# EAGLE schematic main_interrupts_dma (EAGLE 7.6.0), part 1 of 2
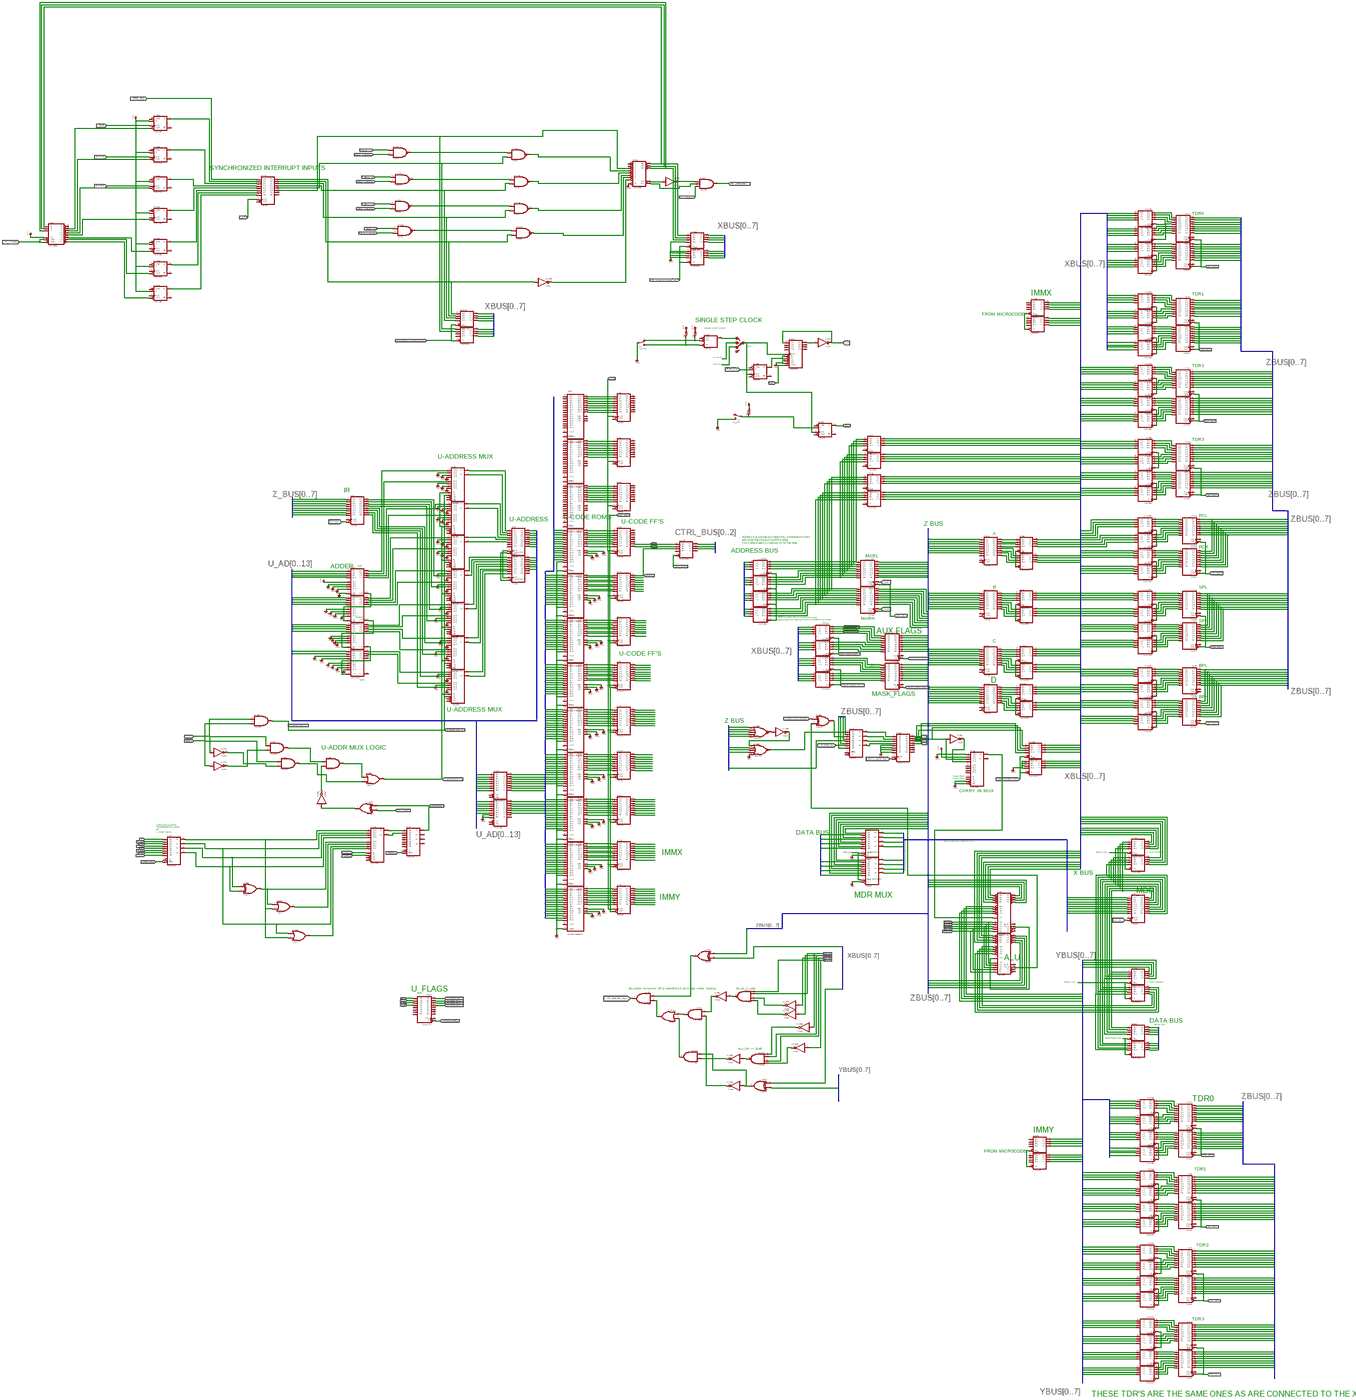
[diagram p0: schematic, sheet 1, overview]
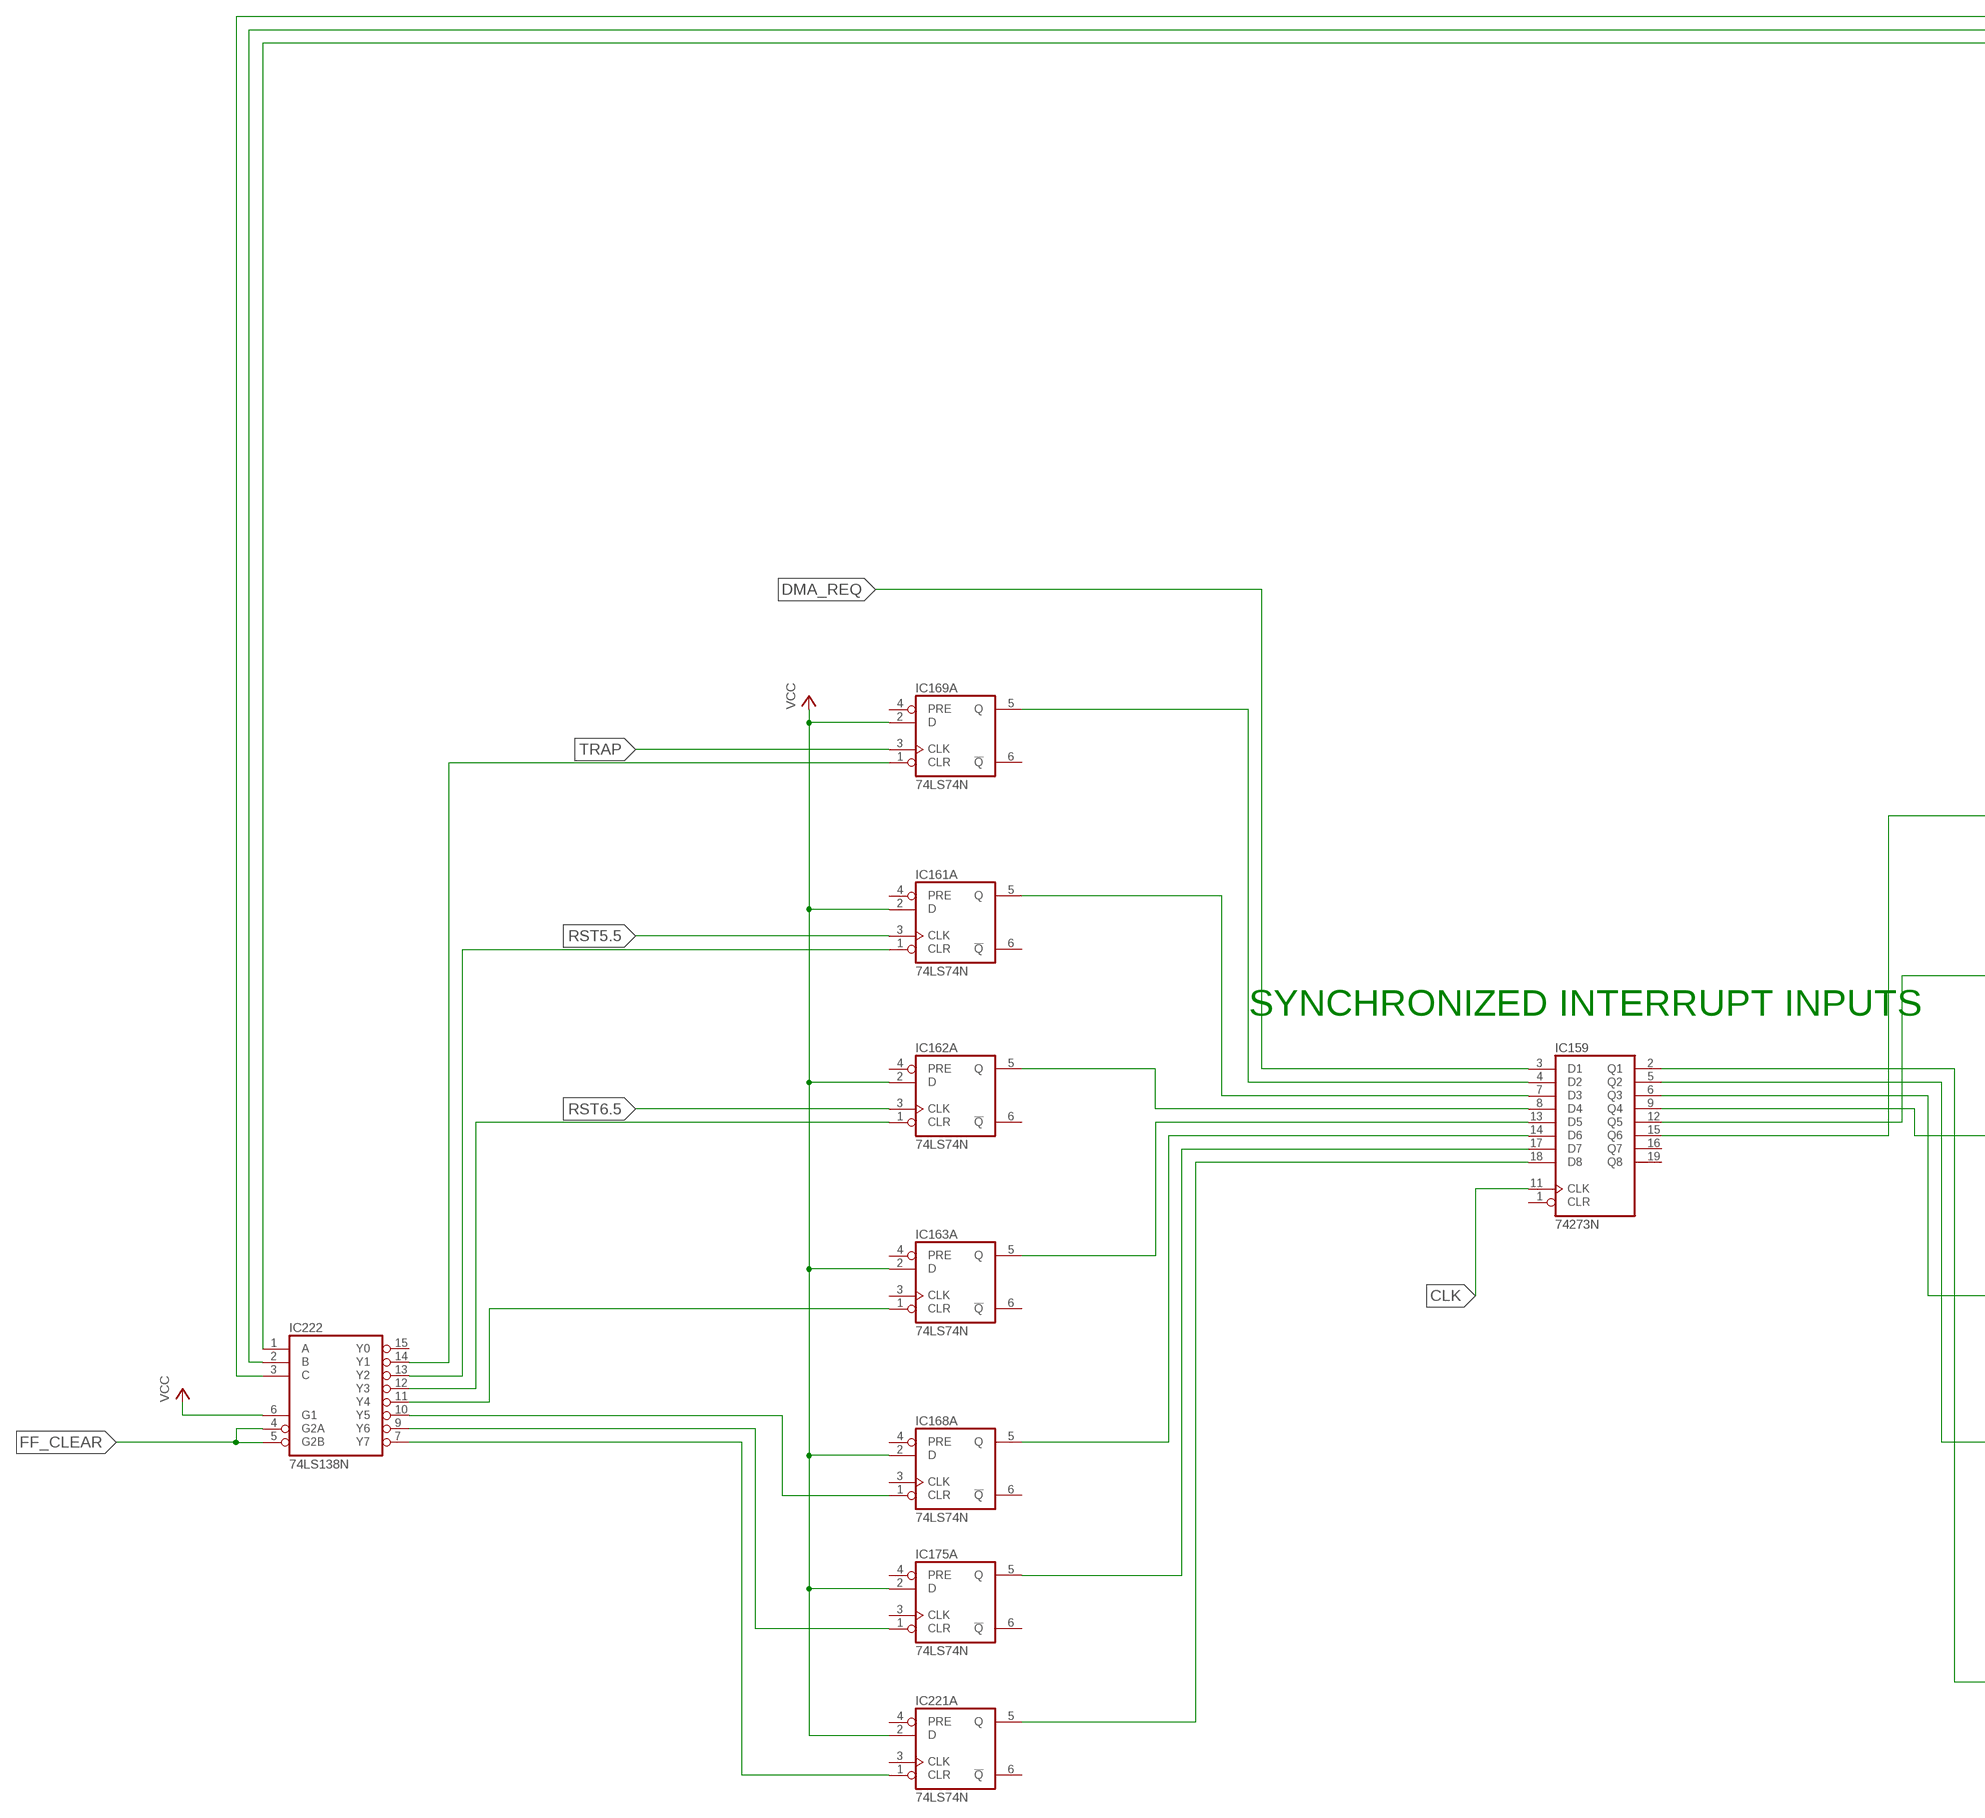
[diagram p1: schematic, sheet 1, part 1 of 8]
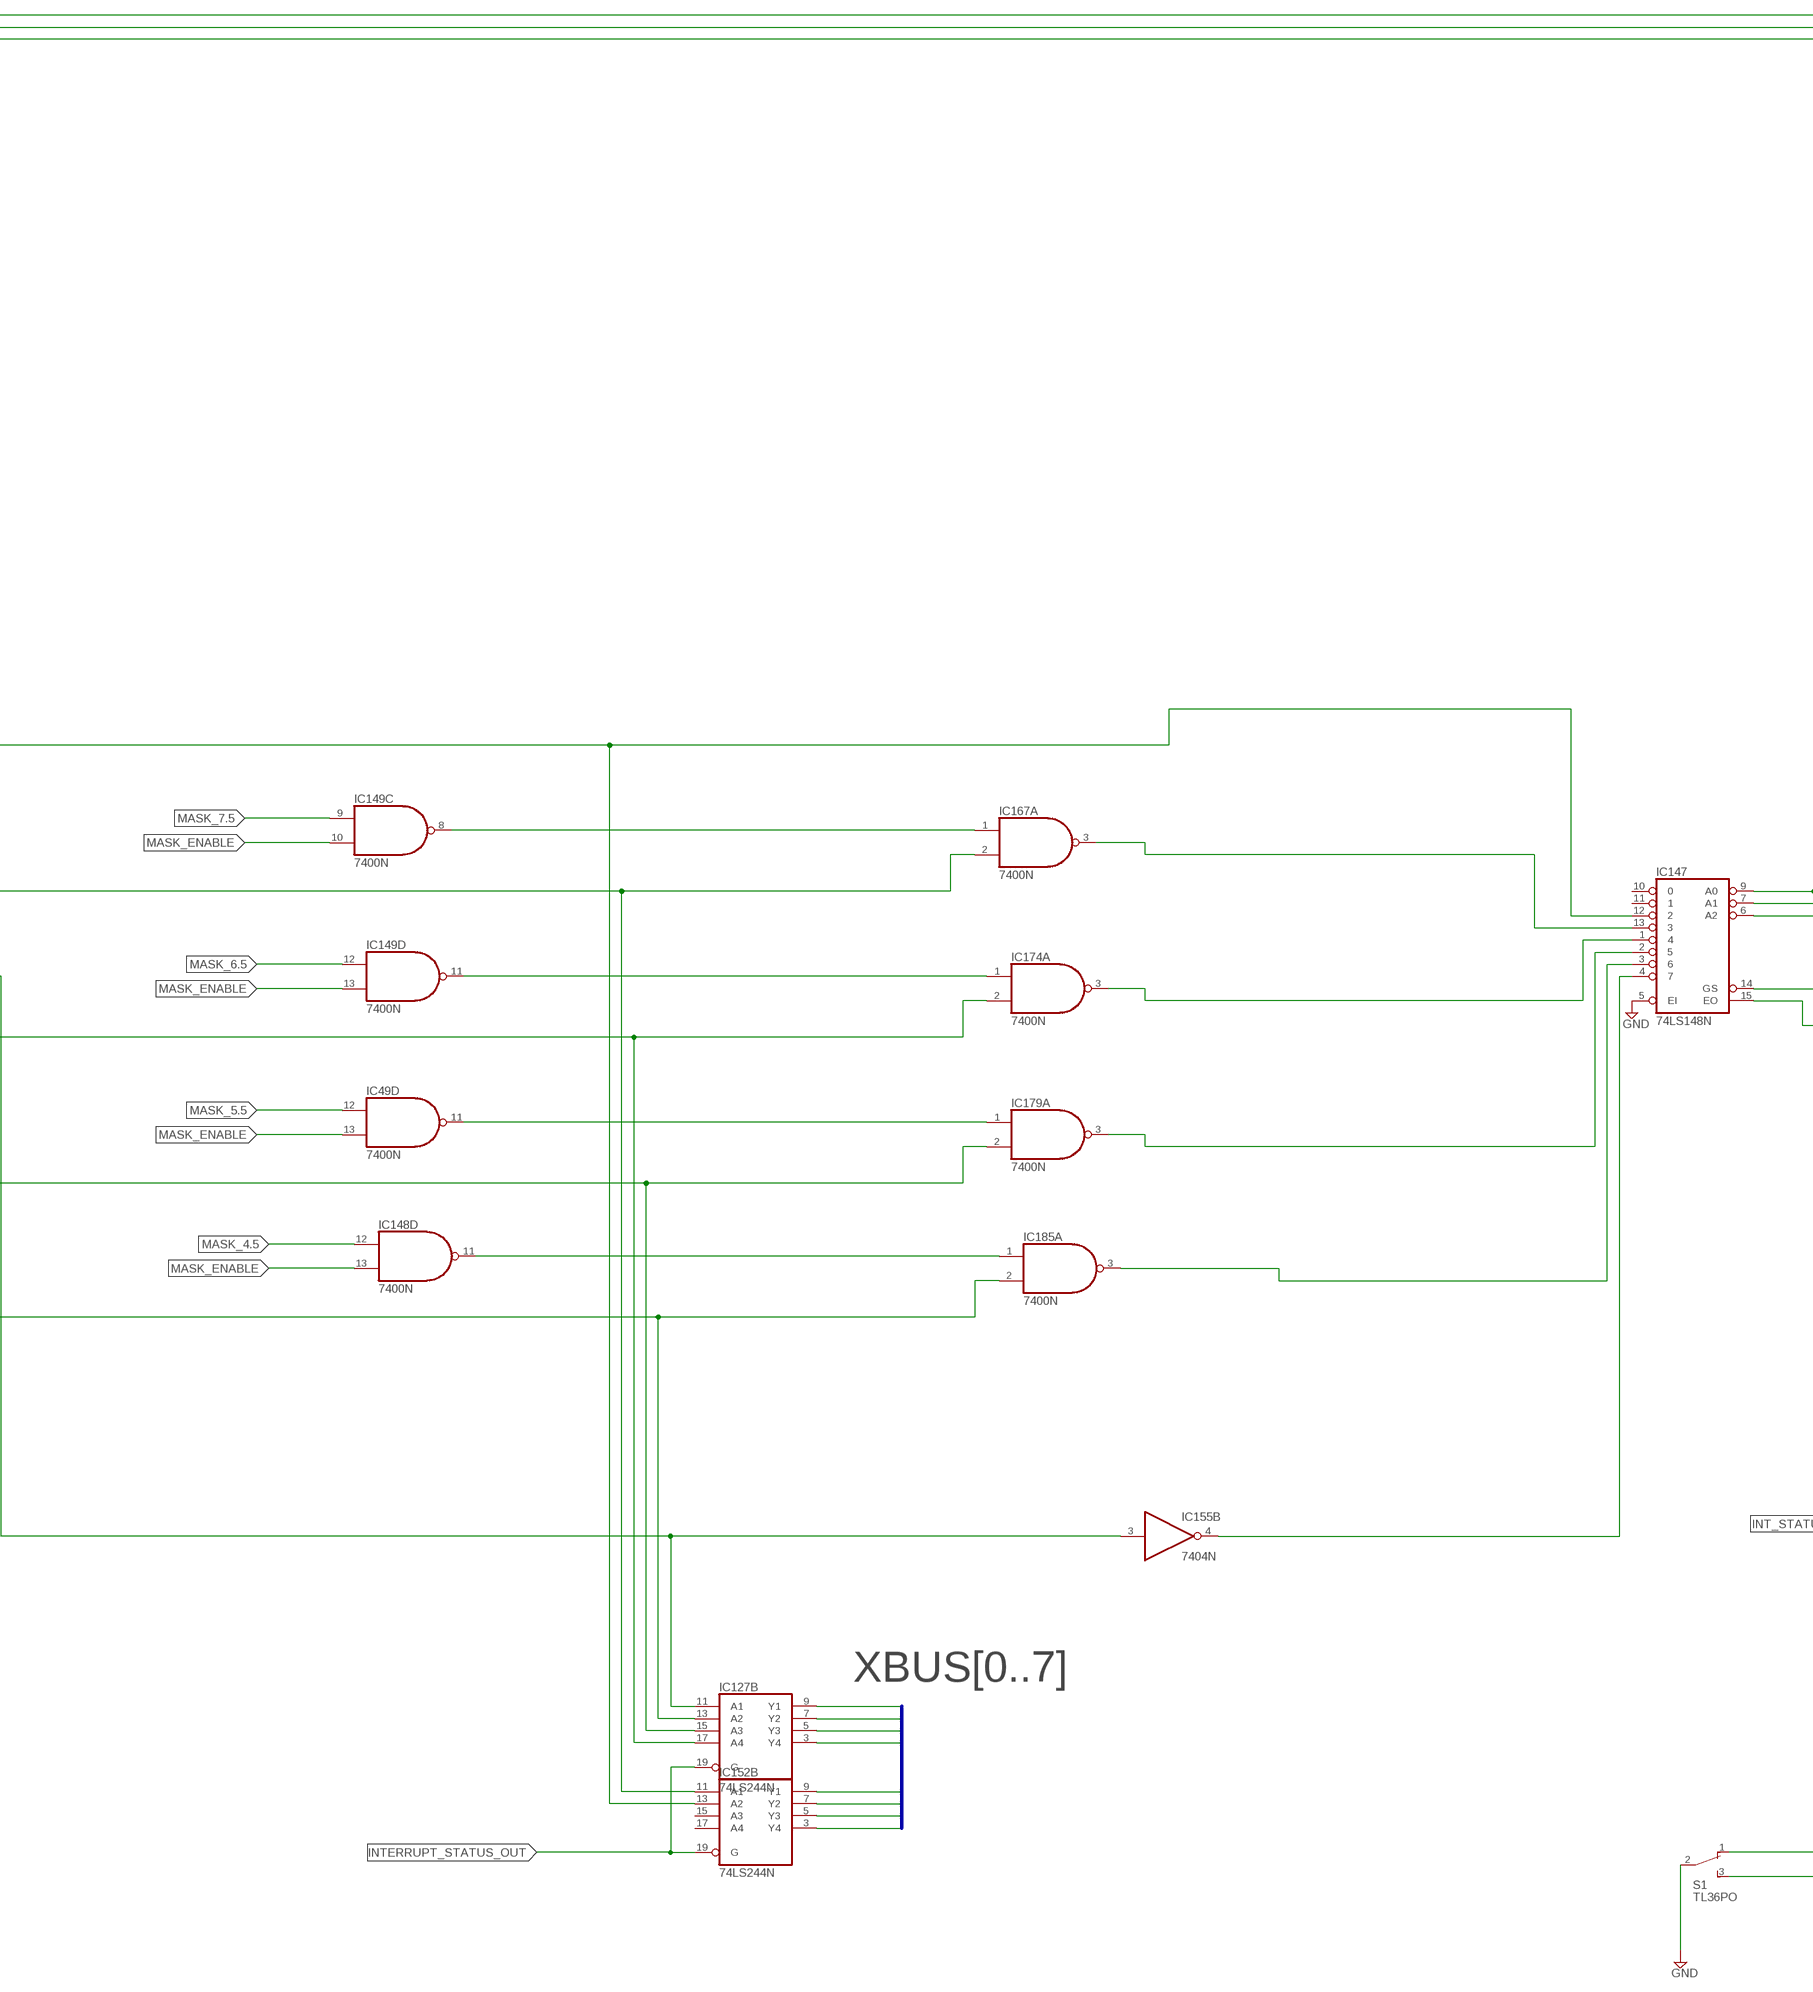
[diagram p2: schematic, sheet 1, part 2 of 8]
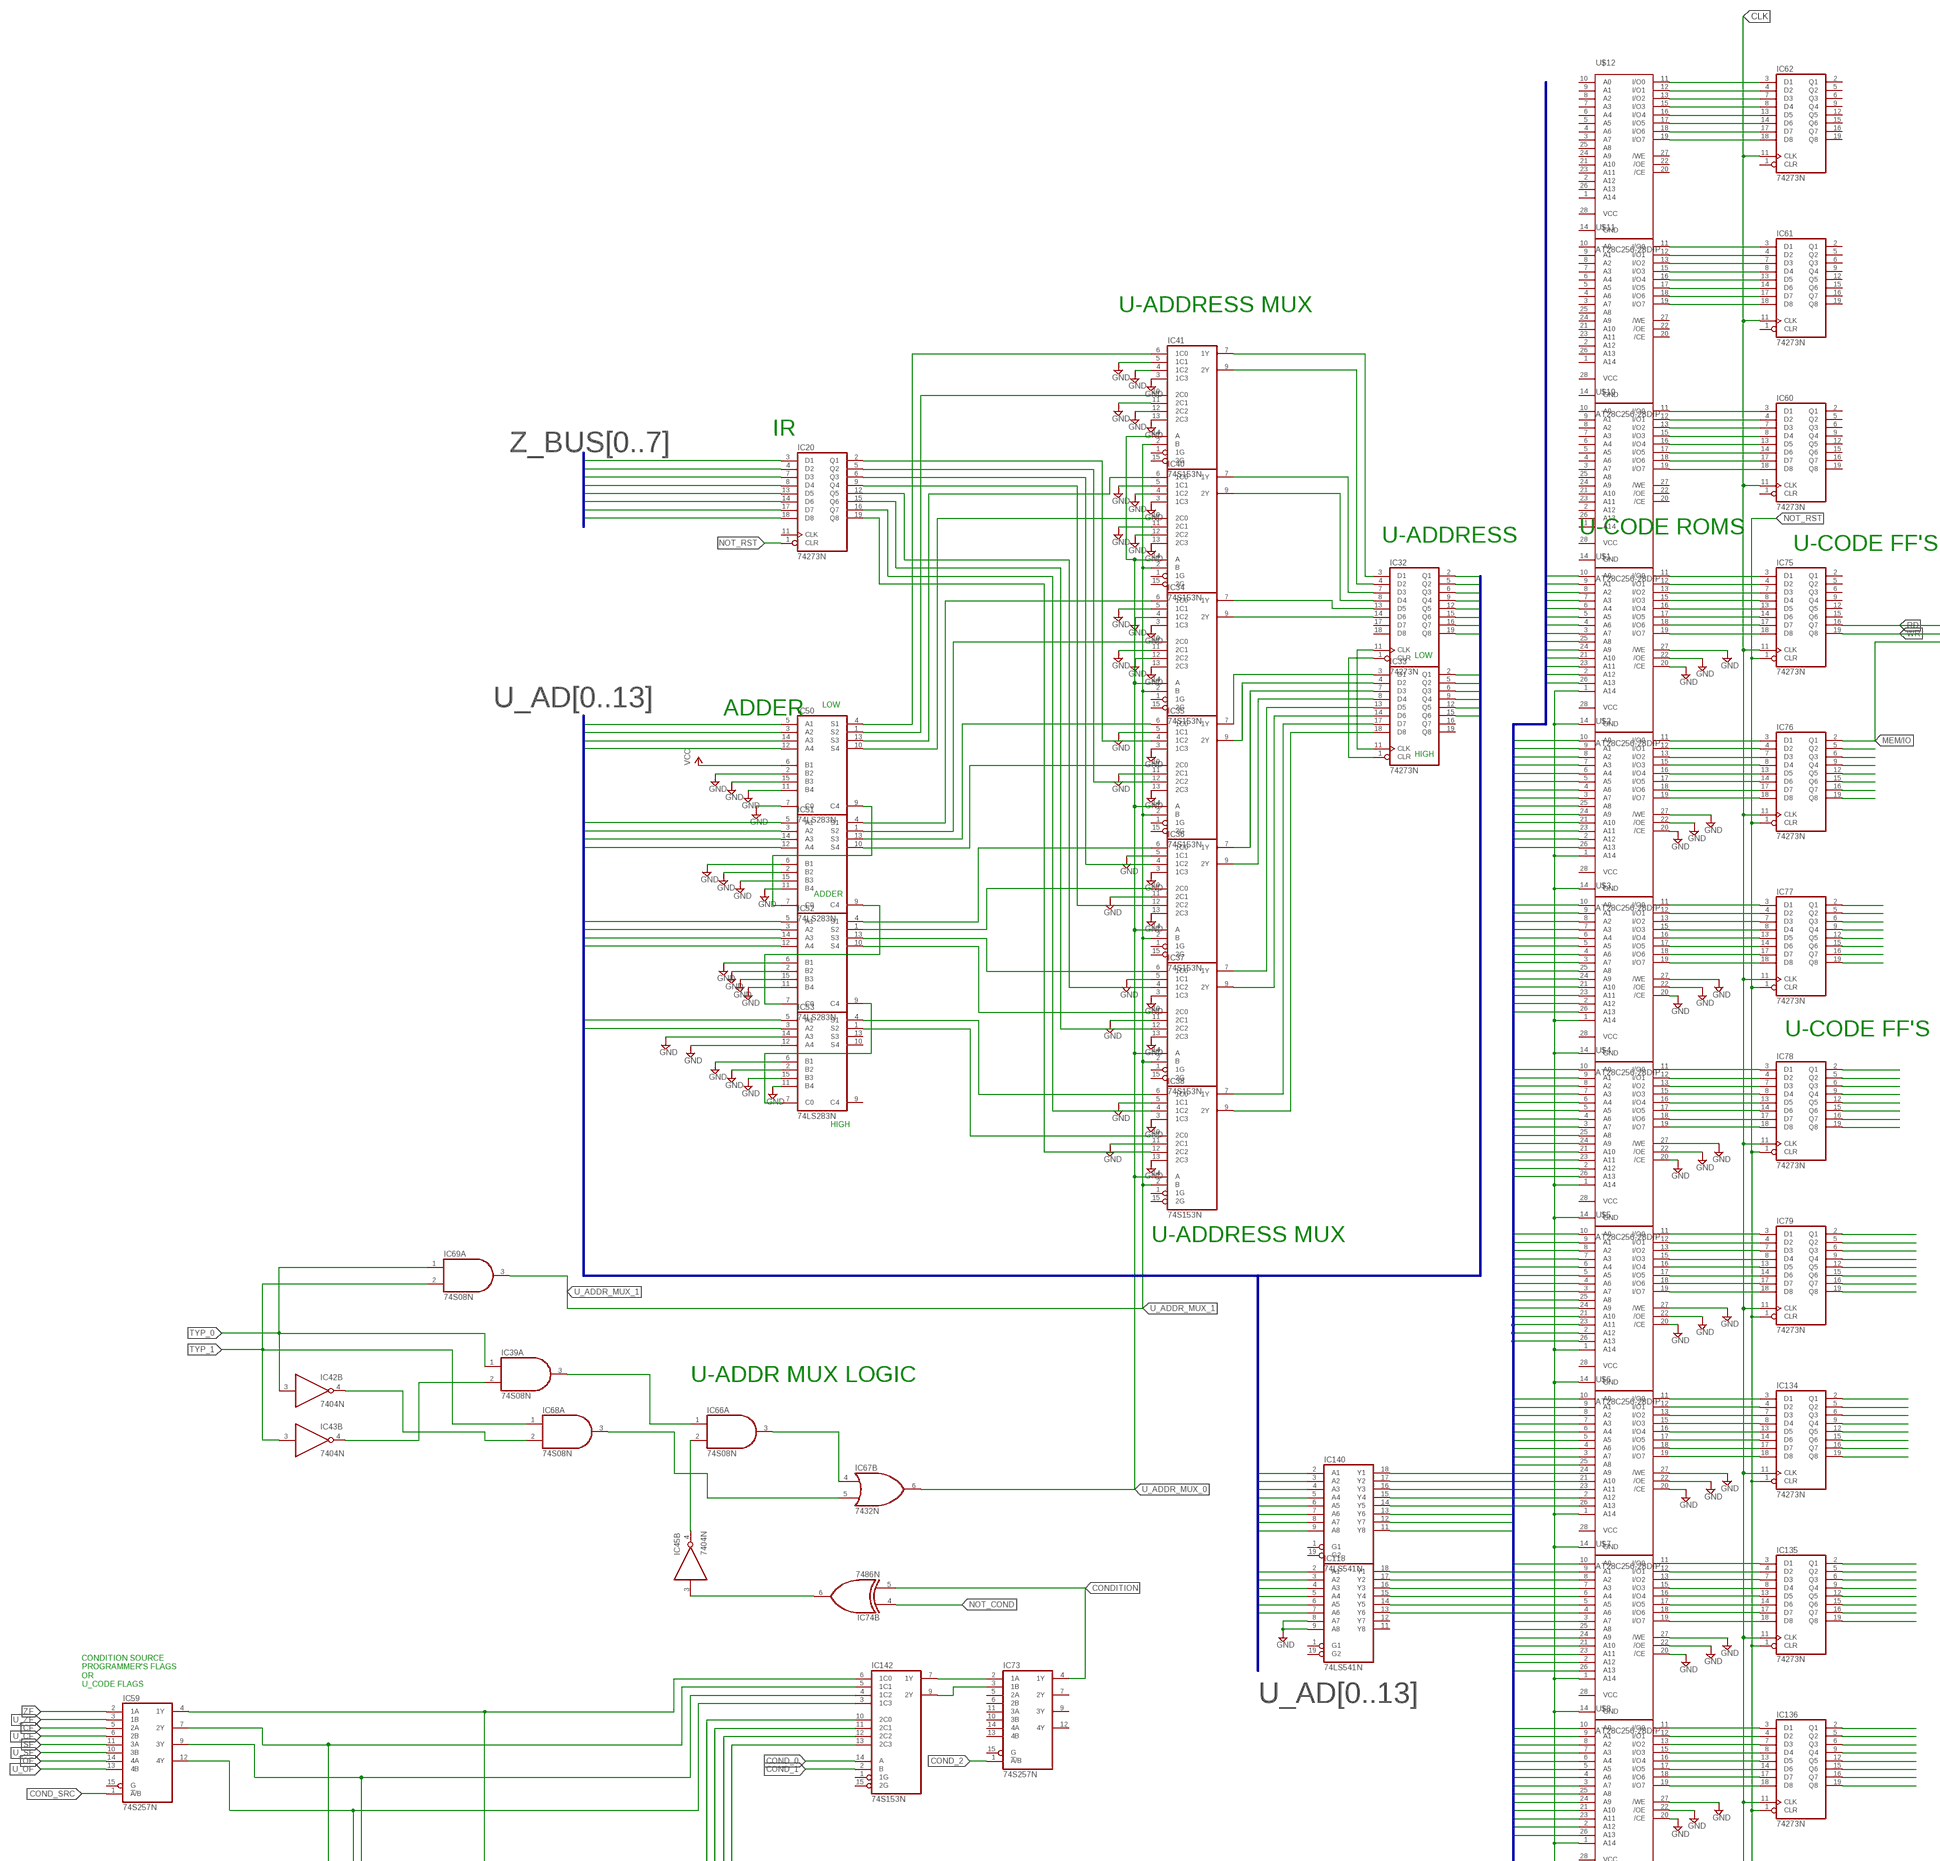
[diagram p3: schematic, sheet 1, part 3 of 8]
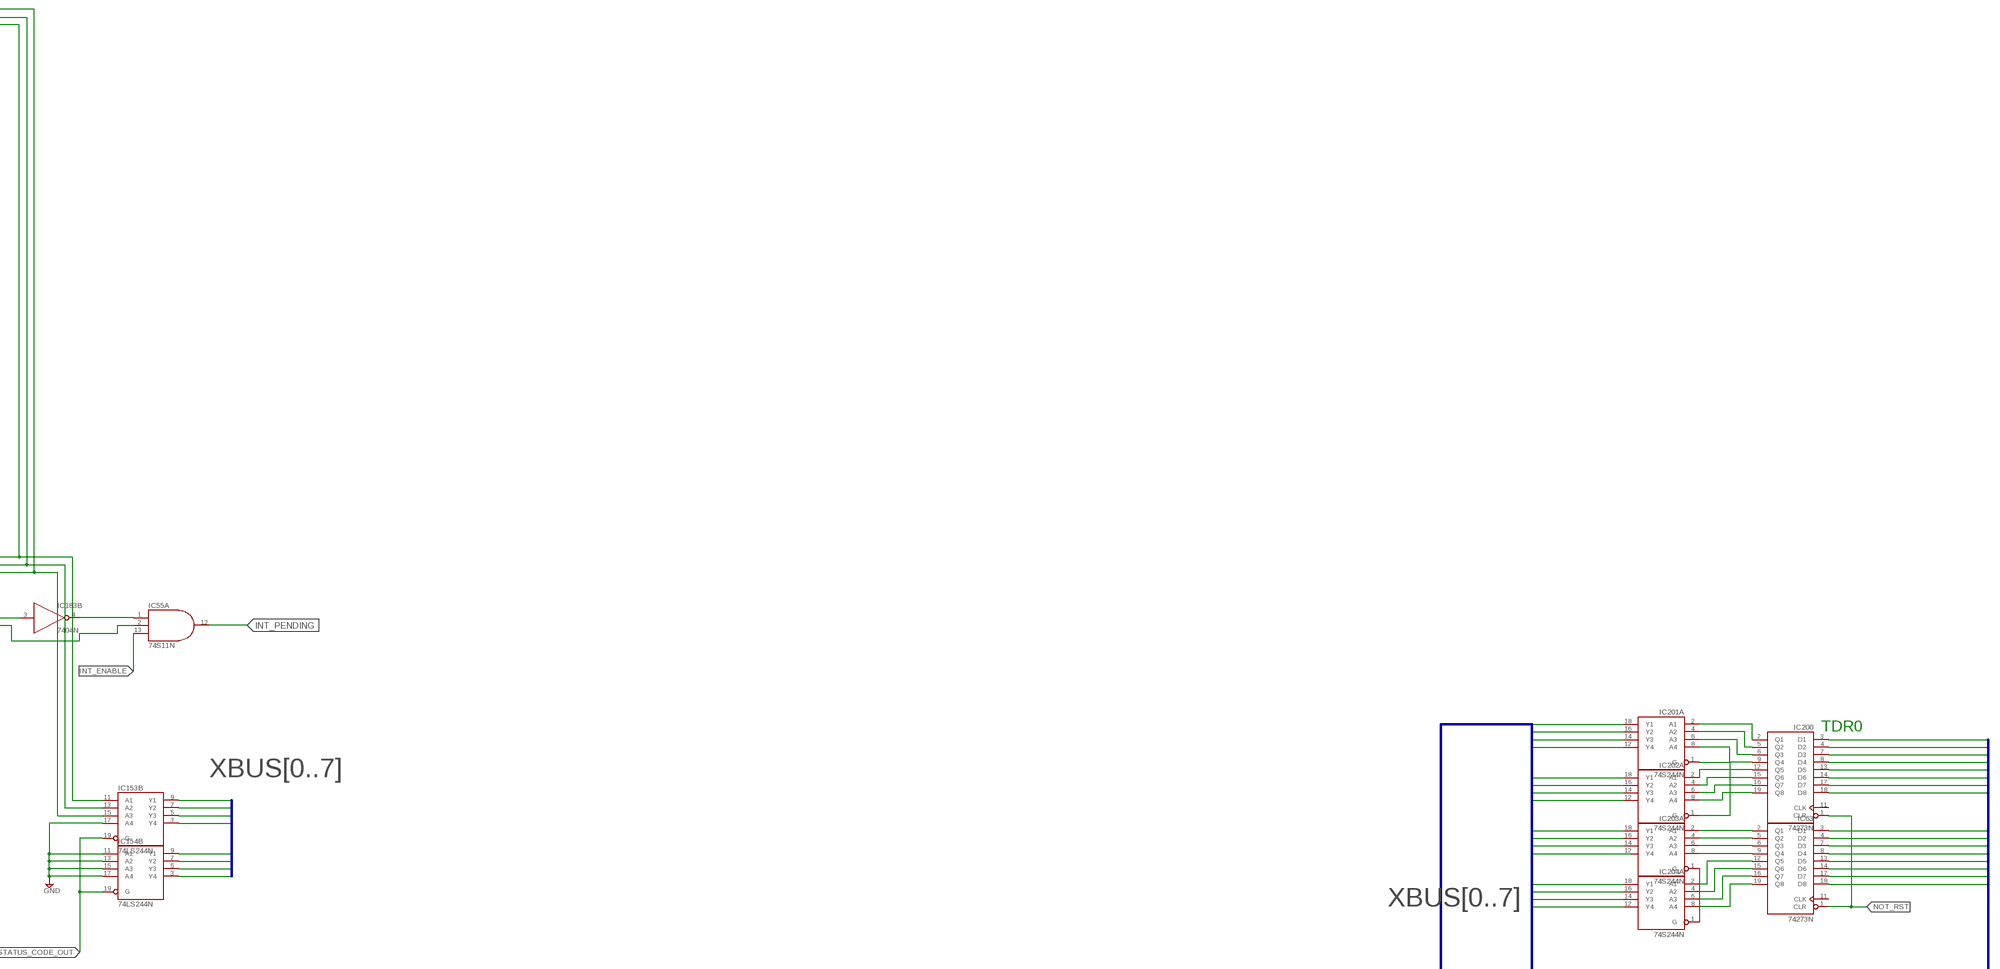
[diagram p4: schematic, sheet 1, part 4 of 8]
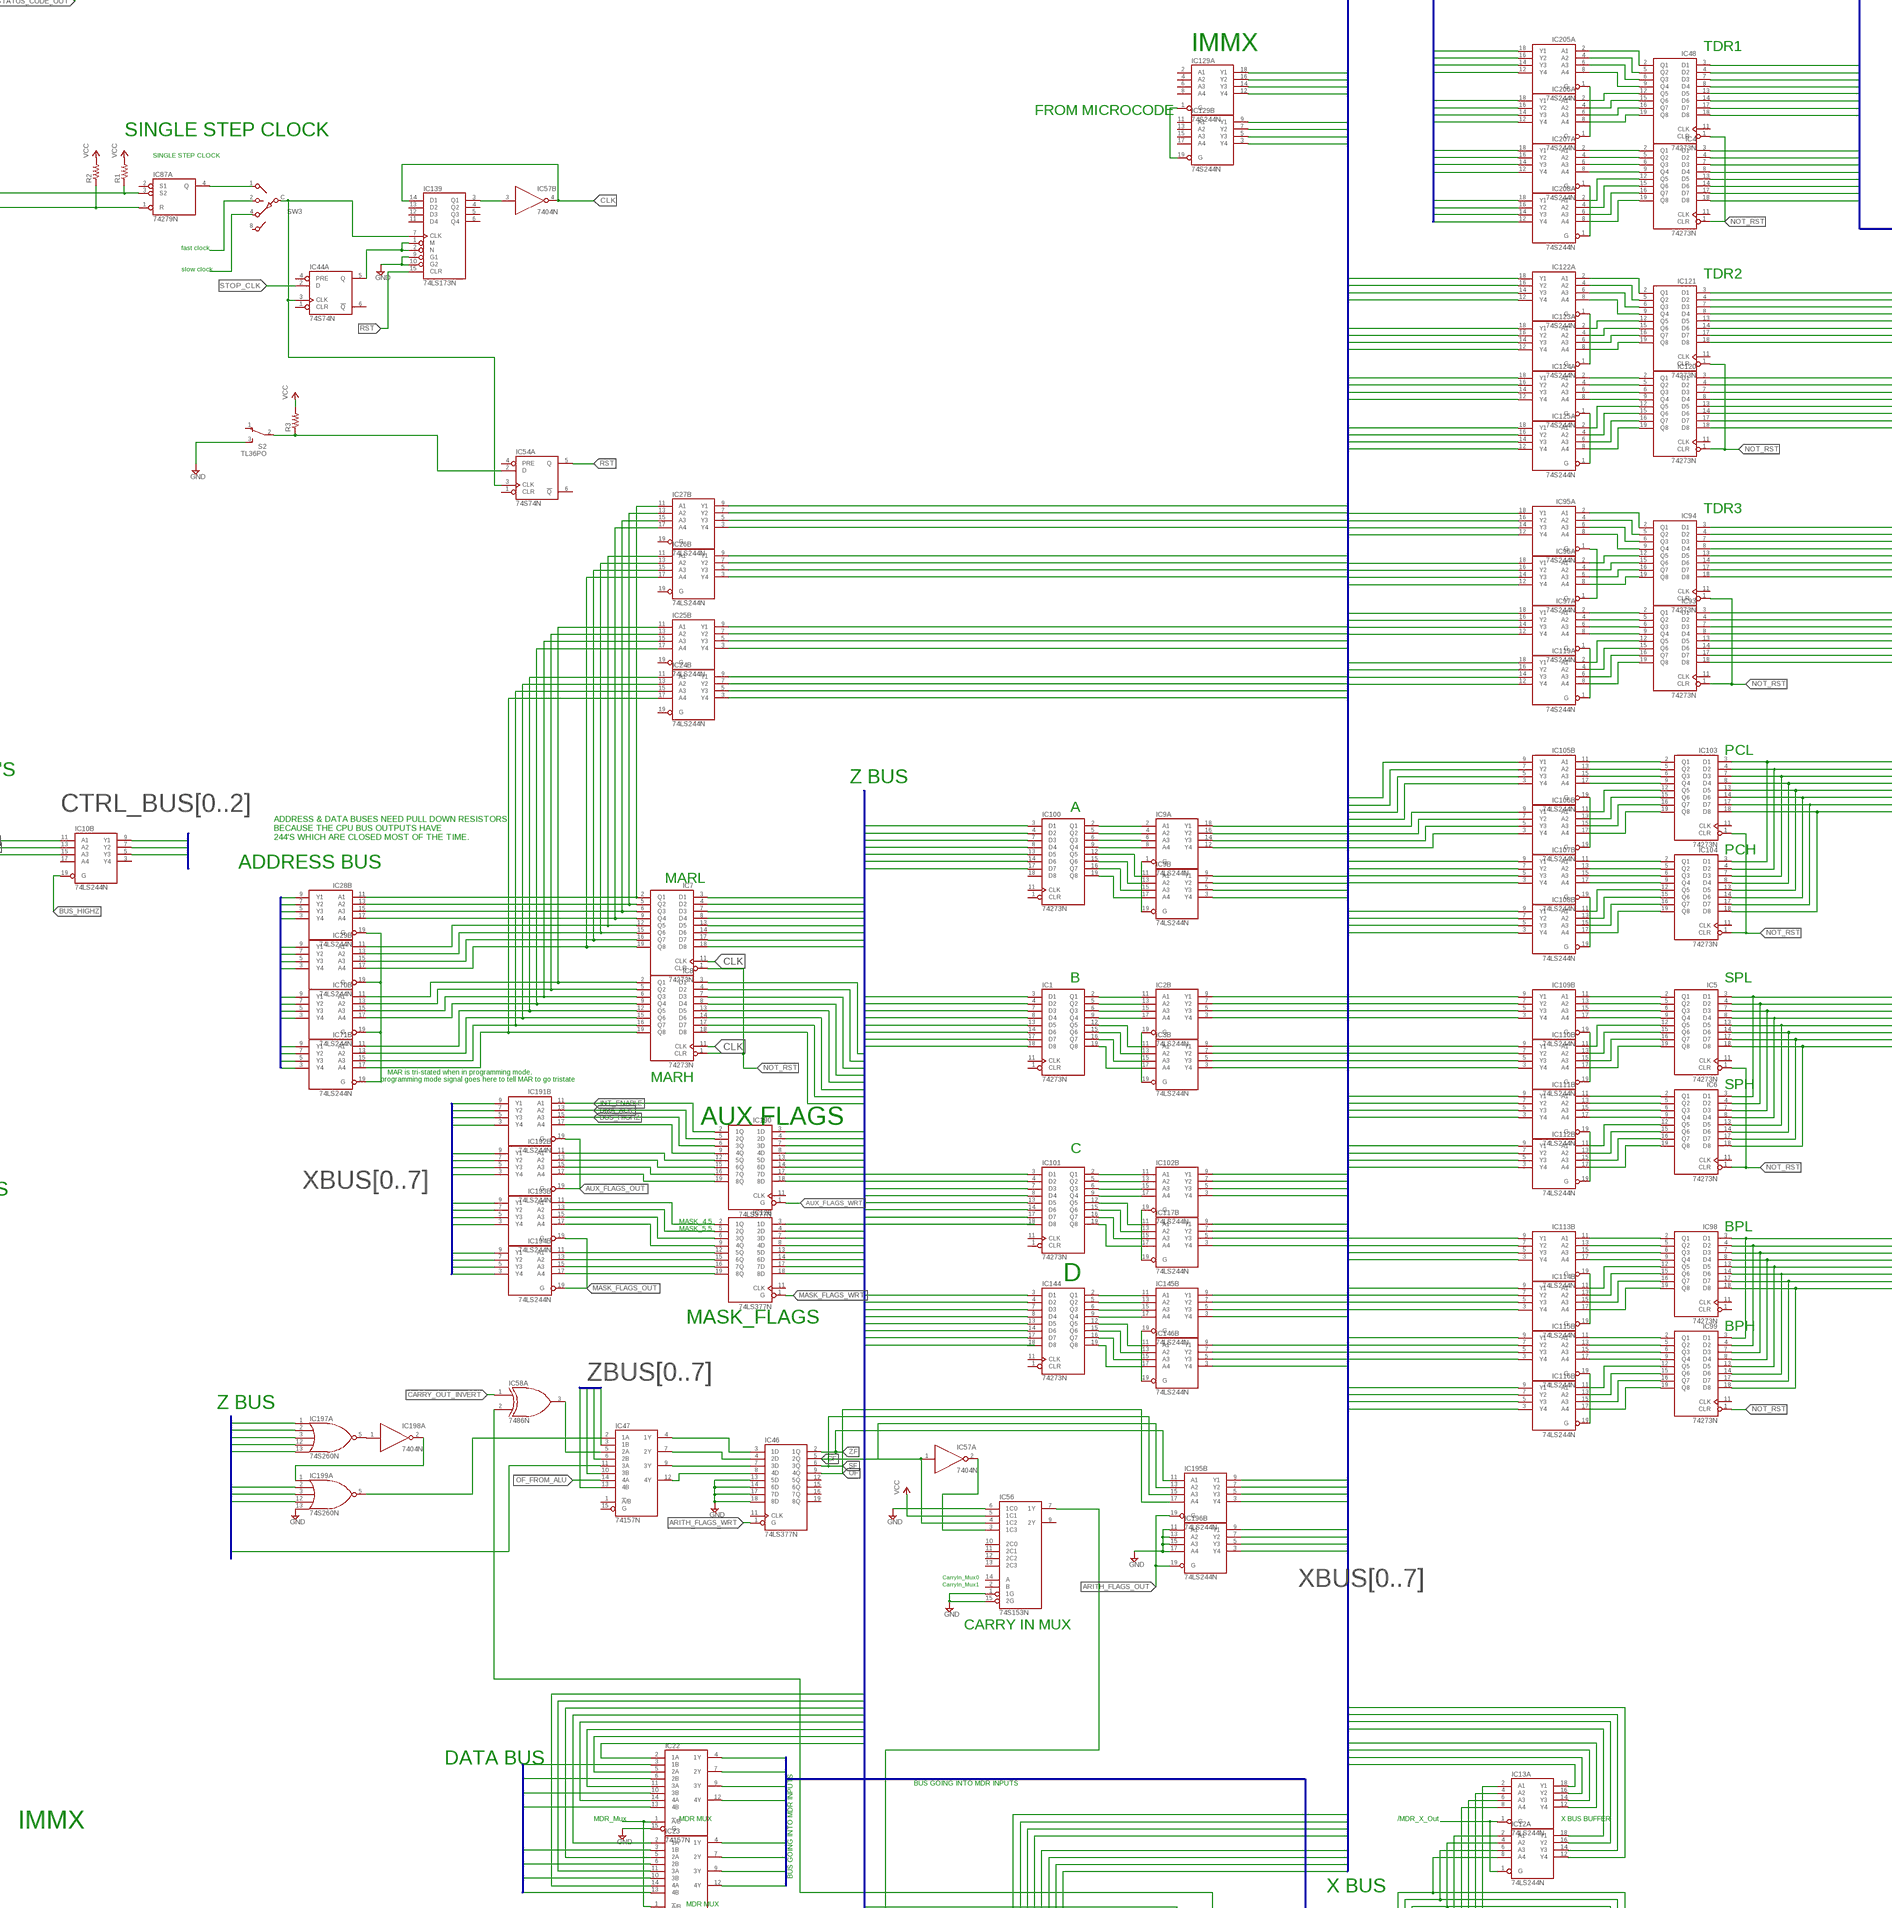
[diagram p5: schematic, sheet 1, part 5 of 8]
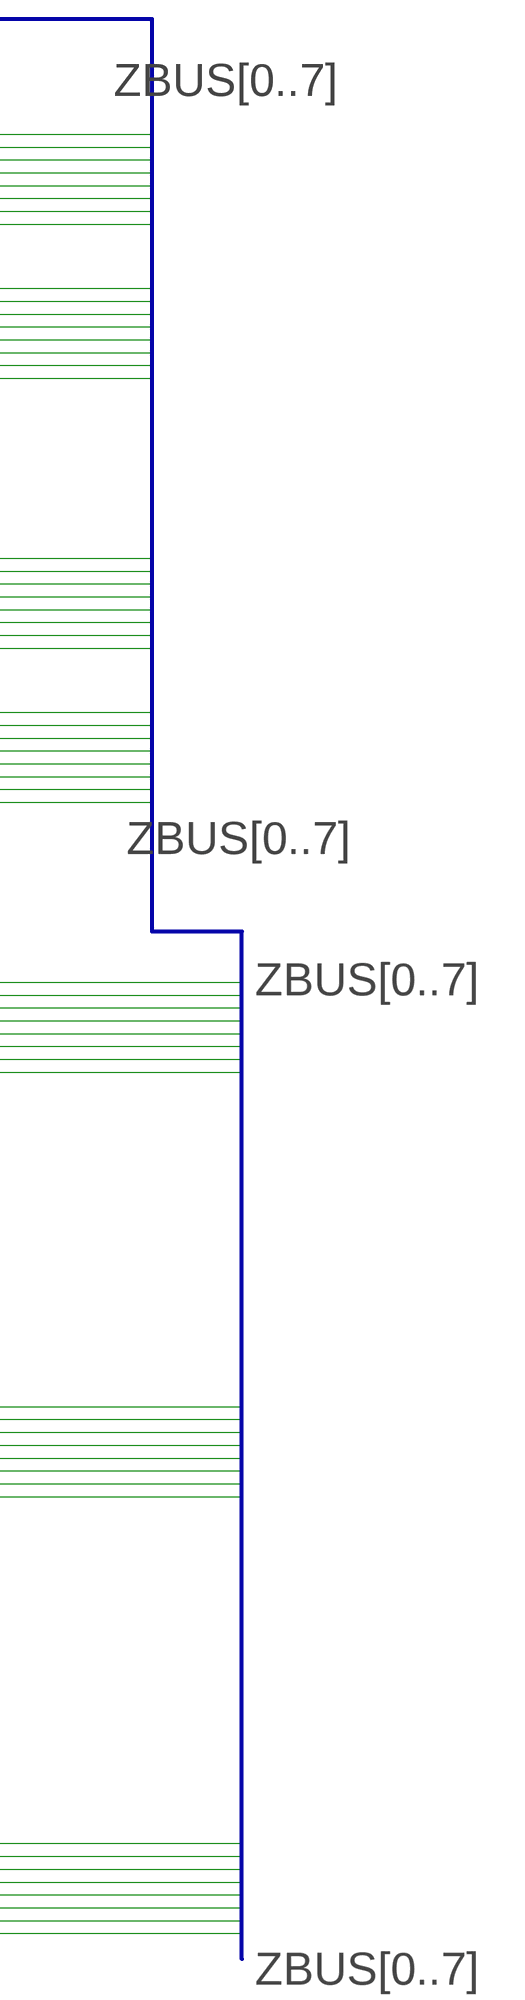
[diagram p6: schematic, sheet 1, part 6 of 8]
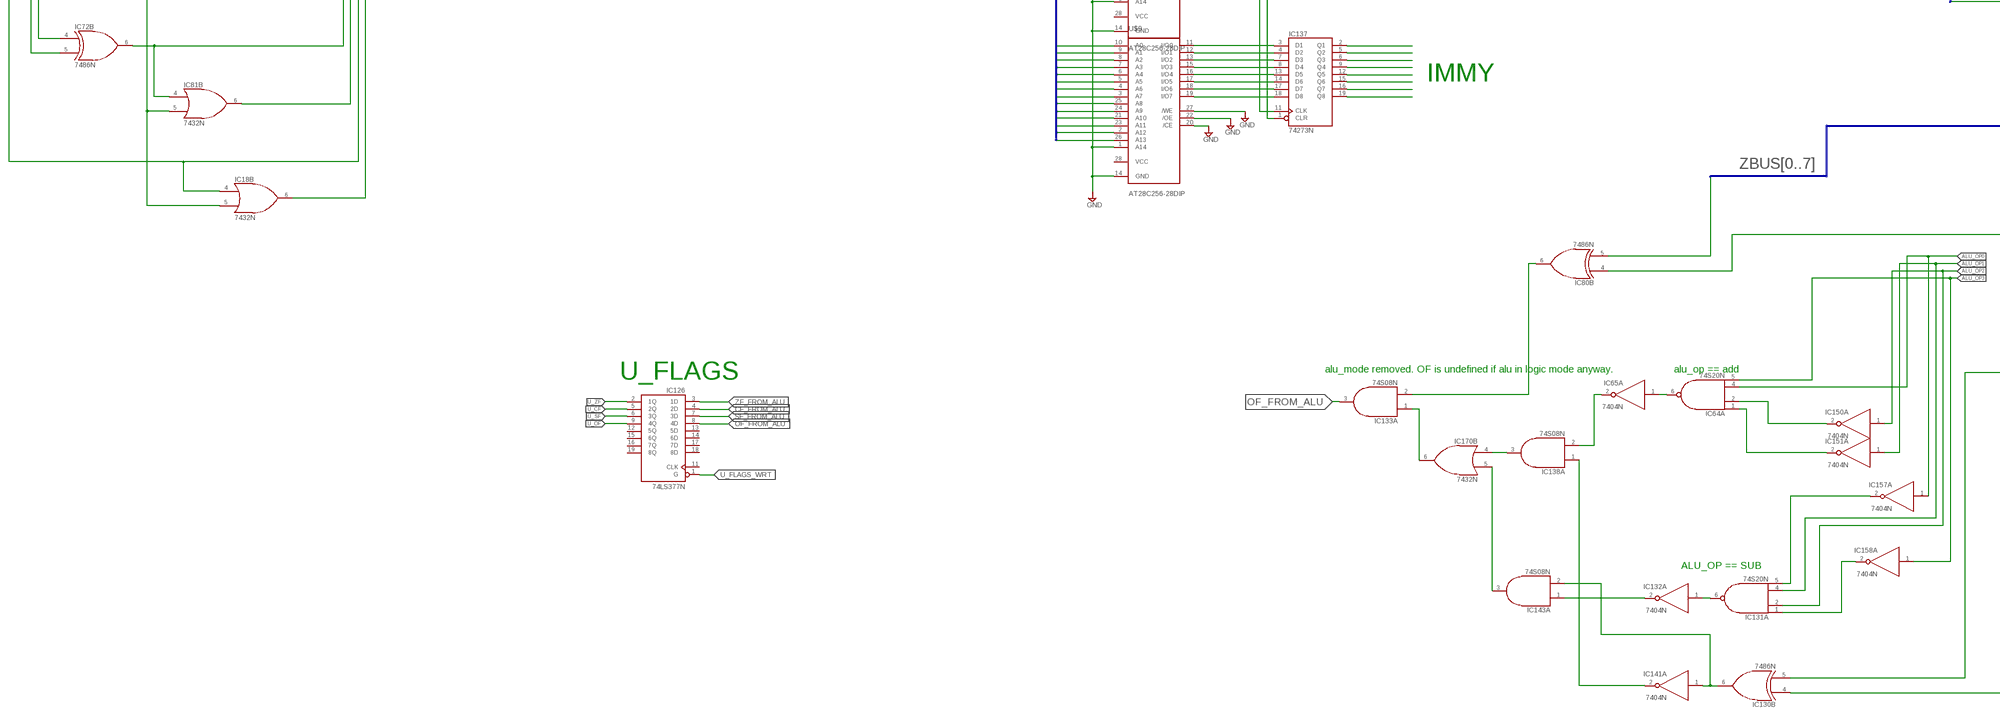
[diagram p7: schematic, sheet 1, part 7 of 8]
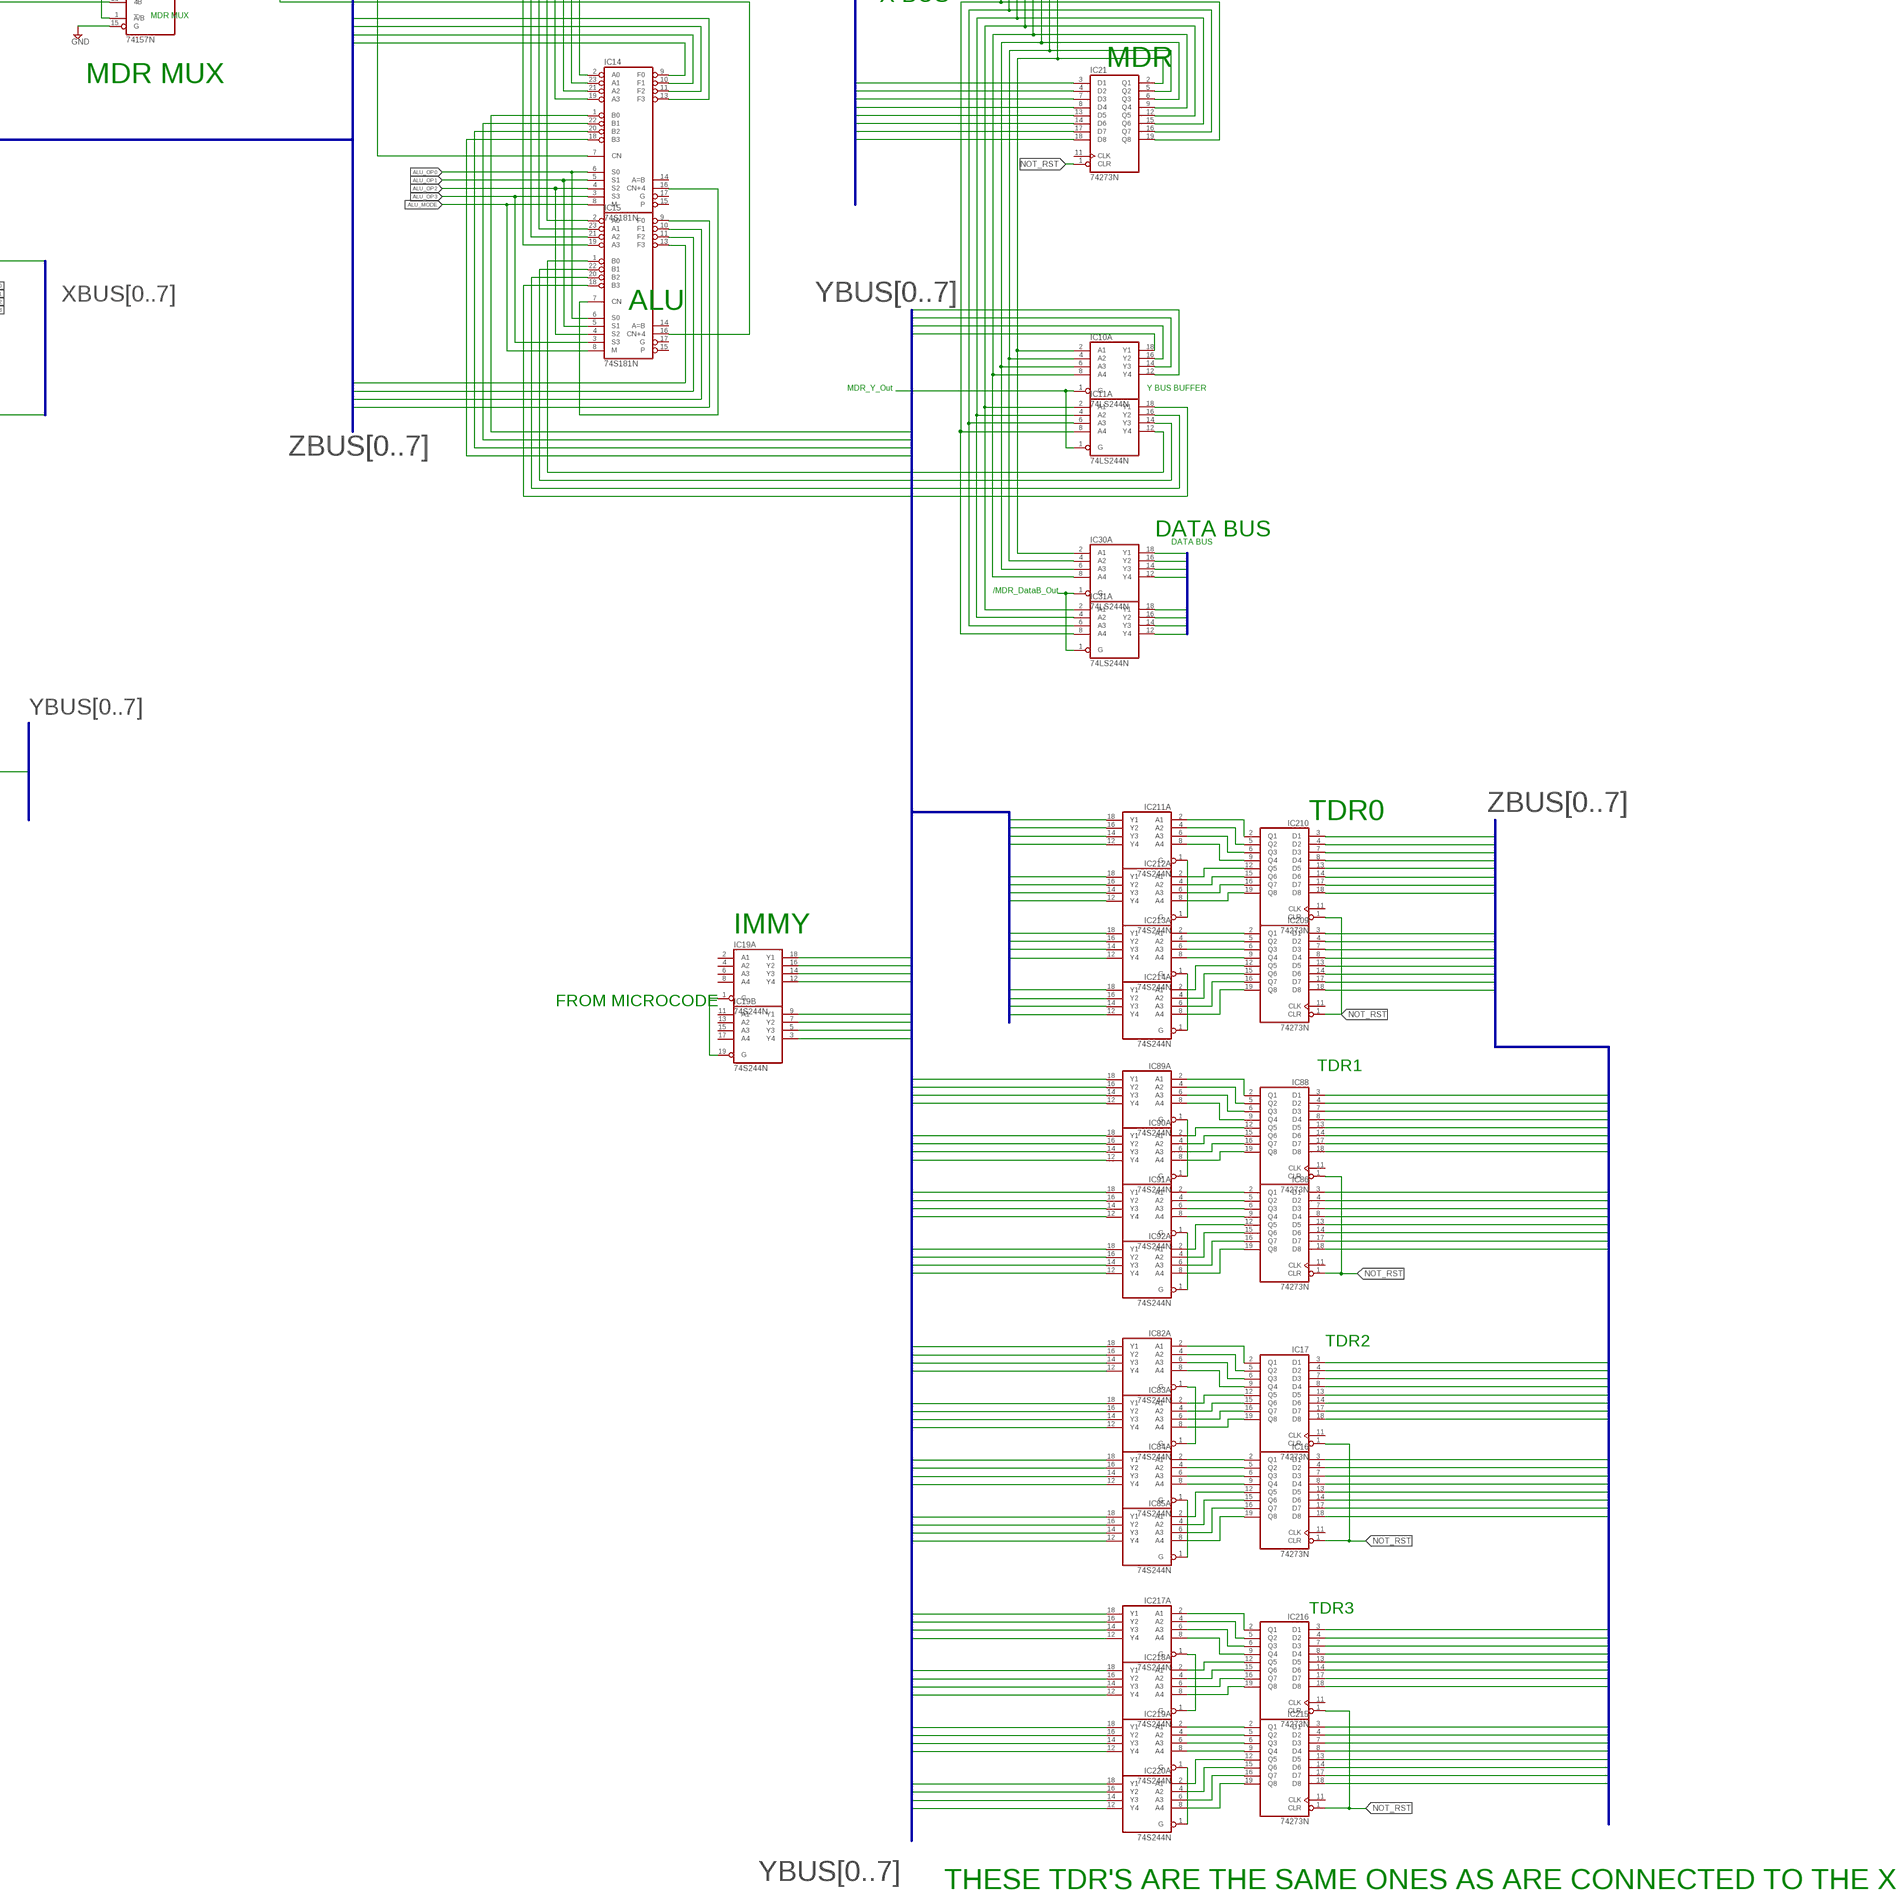
[diagram p8: schematic, sheet 1, part 8 of 8]

## Parts
IC1  74273N  [DIL20]
IC2  74LS244N  [DIL20]
IC3  74LS244N  [DIL20]
IC4  74273N  [DIL20]
IC5  74273N  [DIL20]
IC6  74273N  [DIL20]
IC7  74273N  [DIL20]
IC8  74273N  [DIL20]
IC9  74LS244N  [DIL20]
IC10  74LS244N  [DIL20]
IC11  74LS244N  [DIL20]
IC12  74LS244N  [DIL20]
IC13  74LS244N  [DIL20]
IC14  74S181N  [DIL24-6]
IC15  74S181N  [DIL24-6]
IC16  74273N  [DIL20]
IC17  74273N  [DIL20]
IC18  7432N  [DIL14]
IC19  74S244N  [DIL20]
IC20  74273N  [DIL20]
IC21  74273N  [DIL20]
IC22  74157N  [DIL16]
IC23  74157N  [DIL16]
IC24  74LS244N  [DIL20]
IC25  74LS244N  [DIL20]
IC26  74LS244N  [DIL20]
IC27  74LS244N  [DIL20]
IC28  74LS244N  [DIL20]
IC29  74LS244N  [DIL20]
IC30  74LS244N  [DIL20]
IC31  74LS244N  [DIL20]
IC32  74273N  [DIL20]
IC33  74273N  [DIL20]
IC34  74S153N  [DIL16]
IC35  74S153N  [DIL16]
IC36  74S153N  [DIL16]
IC37  74S153N  [DIL16]
IC38  74S153N  [DIL16]
IC39  74S08N  [DIL14]
IC40  74S153N  [DIL16]
IC41  74S153N  [DIL16]
IC42  7404N  [DIL14]
IC43  7404N  [DIL14]
IC44  74S74N  [DIL14]
IC45  7404N  [DIL14]
IC46  74LS377N  [DIL20]
IC47  74157N  [DIL16]
IC48  74273N  [DIL20]
IC49  7400N  [DIL14]
IC50  74LS283N  [DIL16]
IC51  74LS283N  [DIL16]
IC52  74LS283N  [DIL16]
IC53  74LS283N  [DIL16]
IC54  74S74N  [DIL14]
IC55  74S11N  [DIL14]
IC56  74S153N  [DIL16]
IC57  7404N  [DIL14]
IC58  7486N  [DIL14]
IC59  74S257N  [DIL16]
IC60  74273N  [DIL20]
IC61  74273N  [DIL20]
IC62  74273N  [DIL20]
IC63  74273N  [DIL20]
IC64  74S20N  [DIL14]
IC65  7404N  [DIL14]
IC66  74S08N  [DIL14]
IC67  7432N  [DIL14]
IC68  74S08N  [DIL14]
IC69  74S08N  [DIL14]
IC70  74LS244N  [DIL20]
IC71  74LS244N  [DIL20]
IC72  7486N  [DIL14]
IC73  74S257N  [DIL16]
IC74  7486N  [DIL14]
IC75  74273N  [DIL20]
IC76  74273N  [DIL20]
IC77  74273N  [DIL20]
IC78  74273N  [DIL20]
IC79  74273N  [DIL20]
IC80  7486N  [DIL14]
IC81  7432N  [DIL14]
IC82  74S244N  [DIL20]
IC83  74S244N  [DIL20]
IC84  74S244N  [DIL20]
IC85  74S244N  [DIL20]
IC86  74273N  [DIL20]
IC87  74279N  [DIL16]
IC88  74273N  [DIL20]
IC89  74S244N  [DIL20]
IC90  74S244N  [DIL20]
IC91  74S244N  [DIL20]
IC92  74S244N  [DIL20]
IC93  74273N  [DIL20]
IC94  74273N  [DIL20]
IC95  74S244N  [DIL20]
IC96  74S244N  [DIL20]
IC97  74S244N  [DIL20]
IC98  74273N  [DIL20]
IC99  74273N  [DIL20]
IC100  74273N  [DIL20]
IC101  74273N  [DIL20]
IC102  74LS244N  [DIL20]
IC103  74273N  [DIL20]
IC104  74273N  [DIL20]
IC105  74LS244N  [DIL20]
IC106  74LS244N  [DIL20]
IC107  74LS244N  [DIL20]
IC108  74LS244N  [DIL20]
IC109  74LS244N  [DIL20]
IC110  74LS244N  [DIL20]
IC111  74LS244N  [DIL20]
IC112  74LS244N  [DIL20]
IC113  74LS244N  [DIL20]
IC114  74LS244N  [DIL20]
IC115  74LS244N  [DIL20]
IC116  74LS244N  [DIL20]
IC117  74LS244N  [DIL20]
IC118  74LS541N  [DIL20]
IC119  74S244N  [DIL20]
IC120  74273N  [DIL20]
IC121  74273N  [DIL20]
IC122  74S244N  [DIL20]
IC123  74S244N  [DIL20]
IC124  74S244N  [DIL20]
IC125  74S244N  [DIL20]
IC126  74LS377N  [DIL20]
IC127  74LS244N  [DIL20]
IC128  74LS377N  [DIL20]
IC129  74S244N  [DIL20]
IC130  7486N  [DIL14]
IC131  74S20N  [DIL14]
IC132  7404N  [DIL14]
IC133  74S08N  [DIL14]
IC134  74273N  [DIL20]
IC135  74273N  [DIL20]
IC136  74273N  [DIL20]
IC137  74273N  [DIL20]
IC138  74S08N  [DIL14]
IC139  74LS173N  [DIL16]
IC140  74LS541N  [DIL20]
IC141  7404N  [DIL14]
IC142  74S153N  [DIL16]
IC143  74S08N  [DIL14]
IC144  74273N  [DIL20]
IC145  74LS244N  [DIL20]
IC146  74LS244N  [DIL20]
IC147  74LS148N  [DIL16]
IC148  7400N  [DIL14]
IC149  7400N  [DIL14]
IC150  7404N  [DIL14]
IC151  7404N  [DIL14]
IC152  74LS244N  [DIL20]
IC153  74LS244N  [DIL20]
IC154  74LS244N  [DIL20]
IC155  7404N  [DIL14]
IC157  7404N  [DIL14]
IC158  7404N  [DIL14]
IC159  74273N  [DIL20]
IC161  74LS74N  [DIL14]
IC162  74LS74N  [DIL14]
IC163  74LS74N  [DIL14]
IC167  7400N  [DIL14]
IC168  74LS74N  [DIL14]
IC169  74LS74N  [DIL14]
IC170  7432N  [DIL14]
IC174  7400N  [DIL14]
IC175  74LS74N  [DIL14]
IC179  7400N  [DIL14]
IC183  7404N  [DIL14]
IC185  7400N  [DIL14]
IC190  74LS377N  [DIL20]
IC191  74LS244N  [DIL20]
IC192  74LS244N  [DIL20]
IC193  74LS244N  [DIL20]
IC194  74LS244N  [DIL20]
IC195  74LS244N  [DIL20]
IC196  74LS244N  [DIL20]
IC197  74S260N  [DIL14]
IC198  7404N  [DIL14]
IC199  74S260N  [DIL14]
IC200  74273N  [DIL20]
IC201  74S244N  [DIL20]
IC202  74S244N  [DIL20]
IC203  74S244N  [DIL20]
IC204  74S244N  [DIL20]
IC205  74S244N  [DIL20]
IC206  74S244N  [DIL20]
IC207  74S244N  [DIL20]
IC208  74S244N  [DIL20]
IC209  74273N  [DIL20]
IC210  74273N  [DIL20]
IC211  74S244N  [DIL20]
IC212  74S244N  [DIL20]
IC213  74S244N  [DIL20]
IC214  74S244N  [DIL20]
IC215  74273N  [DIL20]
IC216  74273N  [DIL20]
IC217  74S244N  [DIL20]
IC218  74S244N  [DIL20]
IC219  74S244N  [DIL20]
IC220  74S244N  [DIL20]
IC221  74LS74N  [DIL14]
IC222  74LS138N  [DIL16]
R1  R-US_0204/2V  [0204V]
R2  R-US_0204/2V  [0204V]
R3  R-US_0204/2V  [0204V]
S1  TL36PO  [TL3XPO]
S2  TL36PO  [TL3XPO]
SW3  SW-C10  [SW-C10]
U$1  AT28C256-28DIP  [DIL28-6]
U$2  AT28C256-28DIP  [DIL28-6]
U$3  AT28C256-28DIP  [DIL28-6]
U$4  AT28C256-28DIP  [DIL28-6]
U$5  AT28C256-28DIP  [DIL28-6]
U$6  AT28C256-28DIP  [DIL28-6]
U$7  AT28C256-28DIP  [DIL28-6]
U$8  AT28C256-28DIP  [DIL28-6]
U$9  AT28C256-28DIP  [DIL28-6]
U$10  AT28C256-28DIP  [DIL28-6]
U$11  AT28C256-28DIP  [DIL28-6]
U$12  AT28C256-28DIP  [DIL28-6]

## Nets
45435: IC18.5(B:I1) IC59.4(1Y) IC81.5(B:I1) IC142.6(1C0)
345345: IC59.9(3Y) IC72.4(B:I0) IC142.4(1C2)
634354: IC18.4(B:I0) IC59.7(2Y) IC142.5(1C1) IC142.12(2C2)
4654654: IC59.12(4Y) IC72.5(B:I1) IC142.3(1C3)
AD0: IC28.9(B:Y1)
AD1: IC28.7(B:Y2)
AD2: IC28.5(B:Y3)
AD3: IC28.3(B:Y4)
AD4: IC29.9(B:Y1)
AD5: IC29.7(B:Y2)
AD6: IC29.5(B:Y3)
AD7: IC29.3(B:Y4)
AD8: IC70.9(B:Y1)
AD9: IC70.7(B:Y2)
AD10: IC70.5(B:Y3)
AD11: IC70.3(B:Y4)
AD12: IC71.9(B:Y1)
AD13: IC71.7(B:Y2)
AD14: IC71.5(B:Y3)
AD15: IC71.3(B:Y4)
ALU_MODE: IC14.8(M) IC15.8(M)
ALU_OP0: IC14.6(S0) IC15.6(S0) IC64.4(A:I2) IC157.1(A:I)
ALU_OP1: IC14.5(S1) IC15.5(S1) IC131.4(A:I2) IC151.1(A:I)
ALU_OP2: IC14.4(S2) IC15.4(S2) IC131.2(A:I1) IC150.1(A:I)
ALU_OP3: IC14.3(S3) IC15.3(S3) IC64.5(A:I3) IC158.1(A:I)
ARITH_FLAGS_OUT: IC195.19(B:G) IC196.19(B:G)
AUX_FLAGS_OUT: IC191.19(B:G) IC192.19(B:G)
AUX_FLAGS_WRT: IC190.1(G)
BUS_HIGHZ: IC10.19(B:G) IC28.19(B:G) IC29.19(B:G) IC70.19(B:G) IC71.19(B:G) IC190.6(3Q) IC191.15(B:A3)
CALL_RST_5.5: IC147.3 IC185.3(A:O)
CARRY_OUT_INVERT: IC58.1(A:I0)
CF: IC46.5(2Q) IC56.4(1C2) IC57.1(A:I) IC59.5(2A) IC195.13(B:A2)
CF_FROM_ALU: IC126.4(2D)
CLK: IC7.11(CLK) IC8.11(CLK) IC57.4(B:O) IC60.11(CLK) IC61.11(CLK) IC62.11(CLK) IC75.11(CLK) IC76.11(CLK) IC77.11(CLK) IC78.11(CLK) IC79.11(CLK) IC134.11(CLK) IC135.11(CLK) IC136.11(CLK) IC137.11(CLK) IC139.14(D1) IC159.11(CLK)
COND_0: IC142.14(A)
COND_1: IC142.2(B)
COND_2: IC73.1(!A!/B)
COND_SRC: IC59.1(!A!/B)
CONDITION: IC73.4(1Y) IC74.5(B:I1)
CTRL_BUS0: IC10.9(B:Y1)
CTRL_BUS1: IC10.7(B:Y2)
CTRL_BUS2: IC10.5(B:Y3)
DATA0: IC20.3(D1)
DATA1: IC20.4(D2)
DATA2: IC20.7(D3)
DATA3: IC20.8(D4)
DATA4: IC20.13(D5)
DATA5: IC20.14(D6)
DATA6: IC20.17(D7)
DATA7: IC20.18(D8)
DMA_ACK: IC190.5(2Q) IC191.13(B:A2)
DMA_REQ: IC127.11(B:A1) IC155.3(B:I) IC159.2(Q1) IC159.3(D1)
FF_CLEAR: IC222.4(G2A) IC222.5(G2B)
GND: IC22.15(G) IC23.15(G) IC34.3(1C3) IC34.4(1C2) IC34.5(1C1) IC34.11(2C1) IC34.12(2C2) IC34.13(2C3) IC35.3(1C3) IC35.5(1C1) IC35.11(2C1) IC35.13(2C3) IC36.3(1C3) IC36.5(1C1) IC36.11(2C1) IC36.13(2C3) IC37.3(1C3) IC37.5(1C1) IC37.11(2C1) IC37.13(2C3) IC38.3(1C3) IC38.5(1C1) IC38.11(2C1) IC38.13(2C3) IC40.3(1C3) IC40.4(1C2) IC40.5(1C1) IC40.11(2C1) IC40.12(2C2) IC40.13(2C3) IC41.3(1C3) IC41.4(1C2) IC41.5(1C1) IC41.11(2C1) IC41.12(2C2) IC41.13(2C3) IC46.13(5D) IC46.14(6D) IC46.17(7D) IC46.18(8D) IC50.2(B2) IC50.7(C0) IC50.11(B4) IC50.15(B3) IC51.2(B2) IC51.6(B1) IC51.11(B4) IC51.15(B3) IC52.2(B2) IC52.6(B1) IC52.11(B4) IC52.15(B3) IC53.2(B2) IC53.6(B1) IC53.11(B4) IC53.12(A4) IC53.14(A3) IC53.15(B3) IC56.1(1G) IC56.6(1C0) IC56.15(2G) IC118.8(A7) IC118.9(A8) IC139.9(G1) IC139.10(G2) IC147.5(EI) IC153.17(B:A4) IC154.11(B:A1) IC154.13(B:A2) IC154.15(B:A3) IC154.17(B:A4) IC196.11(B:A1) IC196.13(B:A2) IC196.15(B:A3) IC196.17(B:A4) IC199.13(A:I4) S1.2(P) S2.3(S) U$1.1(A14) U$1.14(GND) U$1.20(/CE) U$1.22(/OE) U$1.27(/WE) U$2.1(A14) U$2.14(GND) U$2.20(/CE) U$2.22(/OE) U$2.27(/WE) U$3.1(A14) U$3.14(GND) U$3.20(/CE) U$3.22(/OE) U$3.27(/WE) U$4.1(A14) U$4.14(GND) U$4.20(/CE) U$4.22(/OE) U$4.27(/WE) U$5.1(A14) U$5.14(GND) U$5.20(/CE) U$5.22(/OE) U$5.27(/WE) U$6.1(A14) U$6.14(GND) U$6.20(/CE) U$6.22(/OE) U$6.27(/WE) U$7.1(A14) U$7.14(GND) U$7.20(/CE) U$7.22(/OE) U$7.27(/WE) U$8.1(A14) U$8.14(GND) U$8.20(/CE) U$8.22(/OE) U$8.27(/WE) U$9.1(A14) U$9.14(GND) U$9.20(/CE) U$9.22(/OE) U$9.27(/WE)
INT_ENABLE: IC55.13(A:I2) IC190.2(1Q) IC191.11(B:A1)
INT_PENDING: IC55.12(A:O)
INT_STATUS_CODE_OUT: IC153.19(B:G) IC154.19(B:G)
INTERRUPT_STATUS_OUT: IC127.19(B:G) IC152.19(B:G)
MASK_4.5: IC148.12(D:I0)
MASK_5.5: IC49.12(D:I0)
MASK_6.5: IC149.12(D:I0)
MASK_7.5: IC149.9(C:I0)
MASK_ENABLE: IC49.13(D:I1) IC148.13(D:I1) IC149.10(C:I1) IC149.13(D:I1)
MASK_FLAGS_OUT: IC193.19(B:G) IC194.19(B:G)
MASK_FLAGS_WRT: IC128.1(G)
MDR_IN_BUS0: IC21.3(D1)
MDR_IN_BUS1: IC21.4(D2)
MDR_IN_BUS2: IC21.7(D3)
MDR_IN_BUS3: IC21.8(D4)
MDR_IN_BUS4: IC21.13(D5)
MDR_IN_BUS5: IC21.14(D6)
MDR_IN_BUS6: IC21.17(D7)
MDR_IN_BUS7: IC21.18(D8)
MEM/IO: IC10.15(B:A3) IC76.2(Q1)
N$1: IC9.2(A:A1) IC100.2(Q1)
N$2: IC9.4(A:A2) IC100.5(Q2)
N$3: IC9.6(A:A3) IC100.6(Q3)
N$4: IC9.8(A:A4) IC100.9(Q4)
N$5: IC9.11(B:A1) IC100.12(Q5)
N$6: IC9.13(B:A2) IC100.15(Q6)
N$7: IC9.15(B:A3) IC100.16(Q7)
N$8: IC9.17(B:A4) IC100.19(Q8)
N$9: IC9.1(A:G) IC9.19(B:G)
N$10: IC80.6(B:O) IC133.2(A:I1)
N$11: IC111.19(B:G) IC112.19(B:G)
N$12: IC109.19(B:G) IC110.19(B:G)
N$13: IC1.2(Q1) IC2.11(B:A1)
N$14: IC7.2(Q1) IC27.11(B:A1) IC28.11(B:A1)
N$15: IC1.5(Q2) IC2.13(B:A2)
N$16: IC1.6(Q3) IC2.15(B:A3)
N$17: IC1.9(Q4) IC2.17(B:A4)
N$18: IC1.12(Q5) IC3.11(B:A1)
N$19: IC1.15(Q6) IC3.13(B:A2)
N$20: IC1.16(Q7) IC3.15(B:A3)
N$21: IC1.19(Q8) IC3.17(B:A4)
N$22: IC2.19(B:G) IC3.19(B:G)
N$23: IC65.2(A:O) IC138.2(A:I1)
N$24: IC143.3(A:O) IC170.5(B:I1)
N$25: IC101.2(Q1) IC102.11(B:A1)
N$26: IC101.5(Q2) IC102.13(B:A2)
N$27: IC101.6(Q3) IC102.15(B:A3)
N$28: IC101.9(Q4) IC102.17(B:A4)
N$29: IC101.12(Q5) IC117.11(B:A1)
N$30: IC101.15(Q6) IC117.13(B:A2)
N$31: IC101.16(Q7) IC117.15(B:A3)
N$32: IC101.19(Q8) IC117.17(B:A4)
N$33: IC103.2(Q1) IC105.11(B:A1)
N$34: IC103.5(Q2) IC105.13(B:A2)
N$35: IC103.6(Q3) IC105.15(B:A3)
N$36: IC103.9(Q4) IC105.17(B:A4)
N$37: IC103.12(Q5) IC106.11(B:A1)
N$38: IC103.15(Q6) IC106.13(B:A2)
N$39: IC103.16(Q7) IC106.15(B:A3)
N$40: IC103.19(Q8) IC106.17(B:A4)
N$41: IC104.2(Q1) IC107.11(B:A1)
N$42: IC104.5(Q2) IC107.13(B:A2)
N$43: IC104.6(Q3) IC107.15(B:A3)
N$44: IC104.9(Q4) IC107.17(B:A4)
N$45: IC104.12(Q5) IC108.11(B:A1)
N$46: IC104.15(Q6) IC108.13(B:A2)
N$47: IC104.16(Q7) IC108.15(B:A3)
N$48: IC104.19(Q8) IC108.17(B:A4)
N$49: IC102.19(B:G) IC117.19(B:G)
N$50: IC130.6(B:O) IC141.1(A:I) IC143.2(A:I1)
N$51: IC7.5(Q2) IC27.13(B:A2) IC28.13(B:A2)
N$52: IC7.6(Q3) IC27.15(B:A3) IC28.15(B:A3)
N$53: IC7.9(Q4) IC27.17(B:A4) IC28.17(B:A4)
N$54: IC7.12(Q5) IC26.11(B:A1) IC29.11(B:A1)
N$55: IC7.15(Q6) IC26.13(B:A2) IC29.13(B:A2)
N$56: IC7.16(Q7) IC26.15(B:A3) IC29.15(B:A3)
N$57: IC7.19(Q8) IC26.17(B:A4) IC29.17(B:A4)
N$58: IC8.2(Q1) IC25.11(B:A1) IC70.11(B:A1)
N$59: IC8.5(Q2) IC25.13(B:A2) IC70.13(B:A2)
N$60: IC8.6(Q3) IC25.15(B:A3) IC70.15(B:A3)
N$61: IC8.9(Q4) IC25.17(B:A4) IC70.17(B:A4)
N$62: IC8.12(Q5) IC24.11(B:A1) IC71.11(B:A1)
N$63: IC8.15(Q6) IC24.13(B:A2) IC71.13(B:A2)
N$64: IC8.16(Q7) IC24.15(B:A3) IC71.15(B:A3)
N$65: IC105.19(B:G) IC106.19(B:G)
N$66: IC107.19(B:G) IC108.19(B:G)
N$67: IC5.2(Q1) IC109.11(B:A1)
N$68: IC5.5(Q2) IC109.13(B:A2)
N$69: IC5.6(Q3) IC109.15(B:A3)
N$70: IC5.9(Q4) IC109.17(B:A4)
N$71: IC5.12(Q5) IC110.11(B:A1)
N$72: IC5.15(Q6) IC110.13(B:A2)
N$73: IC8.19(Q8) IC24.17(B:A4) IC71.17(B:A4)
N$74: IC200.2(Q1) IC201.2(A:A1)
N$75: IC200.5(Q2) IC201.4(A:A2)
N$76: IC44.2(A:D)
N$77: IC75.3(D1) U$1.11(I/O0)
N$79: IC73.3(1B) IC142.9(2Y)
N$80: IC45.3(B:I) IC74.6(B:O)
N$81: IC138.1(A:I0) IC141.2(A:O)
N$82: IC138.3(A:O) IC170.4(B:I0)
N$83: IC10.2(A:A1) IC13.2(A:A1) IC21.2(Q1) IC30.2(A:A1)
N$84: IC133.1(A:I0) IC170.6(B:O)
N$85: IC64.6(A:O) IC65.1(A:I)
N$86: IC64.2(A:I1) IC150.2(A:O)
N$87: IC144.2(Q1) IC145.11(B:A1)
N$88: IC64.1(A:I0) IC151.2(A:O)
N$89: IC131.6(A:O) IC132.1(A:I)
N$90: IC132.2(A:O) IC143.1(A:I0)
N$91: IC14.2(A0)
N$92: IC14.23(A1)
N$93: IC14.21(A2)
N$94: IC14.19(A3)
N$95: IC15.2(A0)
N$96: IC15.23(A1)
N$97: IC15.21(A2)
N$98: IC15.19(A3)
N$99: IC14.1(B0)
N$100: IC14.22(B1)
N$101: IC14.20(B2)
N$102: IC14.18(B3)
N$103: IC11.12(A:Y4) IC15.1(B0)
N$104: IC11.14(A:Y3) IC15.22(B1)
N$105: IC11.16(A:Y2) IC15.20(B2)
N$106: IC11.18(A:Y1) IC15.18(B3)
N$107: IC14.16(CN+4) IC15.7(CN)
N$108: IC46.4(2D) IC47.7(2Y)
N$109: IC144.5(Q2) IC145.13(B:A2)
N$110: IC131.5(A:I3) IC157.2(A:O)
N$111: IC144.6(Q3) IC145.15(B:A3)
N$112: IC144.9(Q4) IC145.17(B:A4)
N$113: IC131.1(A:I0) IC158.2(A:O)
N$114: IC88.2(Q1) IC89.2(A:A1)
N$115: IC88.5(Q2) IC89.4(A:A2)
N$116: IC88.6(Q3) IC89.6(A:A3)
N$117: IC88.9(Q4) IC89.8(A:A4)
N$118: IC88.12(Q5) IC90.2(A:A1)
N$119: IC88.15(Q6) IC90.4(A:A2)
N$120: IC88.16(Q7) IC90.6(A:A3)
N$121: IC88.19(Q8) IC90.8(A:A4)
N$122: IC86.2(Q1) IC91.2(A:A1)
N$123: IC86.5(Q2) IC91.4(A:A2)
N$124: IC86.6(Q3) IC91.6(A:A3)
N$125: IC86.9(Q4) IC91.8(A:A4)
N$126: IC86.12(Q5) IC92.2(A:A1)
N$127: IC86.15(Q6) IC92.4(A:A2)
N$128: IC86.16(Q7) IC92.6(A:A3)
N$129: IC86.19(Q8) IC92.8(A:A4)
N$130: IC89.1(A:G) IC90.1(A:G)
N$131: IC19.1(A:G) IC19.19(B:G)
N$132: IC10.4(A:A2) IC13.4(A:A2) IC21.5(Q2) IC30.4(A:A2)
N$133: IC91.1(A:G) IC92.1(A:G)
N$134: IC10.6(A:A3) IC13.6(A:A3) IC21.6(Q3) IC30.6(A:A3)
N$135: IC144.12(Q5) IC146.11(B:A1)
N$136: IC144.15(Q6) IC146.13(B:A2)
N$137: IC10.8(A:A4) IC13.8(A:A4) IC21.9(Q4) IC30.8(A:A4)
N$138: IC11.2(A:A1) IC12.2(A:A1) IC21.12(Q5) IC31.2(A:A1)
N$139: IC144.16(Q7) IC146.15(B:A3)
N$140: IC11.4(A:A2) IC12.4(A:A2) IC21.15(Q6) IC31.4(A:A2)
N$141: IC11.6(A:A3) IC12.6(A:A3) IC21.16(Q7) IC31.6(A:A3)
N$142: IC144.19(Q8) IC146.17(B:A4)
N$143: IC5.16(Q7) IC110.15(B:A3)
N$144: IC121.2(Q1) IC122.2(A:A1)
N$145: IC121.5(Q2) IC122.4(A:A2)
N$146: IC5.19(Q8) IC110.17(B:A4)
N$147: IC121.6(Q3) IC122.6(A:A3)
N$148: IC121.9(Q4) IC122.8(A:A4)
N$149: IC121.12(Q5) IC123.2(A:A1)
N$150: IC121.15(Q6) IC123.4(A:A2)
N$151: IC6.2(Q1) IC111.11(B:A1)
N$152: IC121.16(Q7) IC123.6(A:A3)
N$153: IC121.19(Q8) IC123.8(A:A4)
N$154: IC120.2(Q1) IC124.2(A:A1)
N$155: IC120.5(Q2) IC124.4(A:A2)
N$156: IC120.6(Q3) IC124.6(A:A3)
N$157: IC120.9(Q4) IC124.8(A:A4)
N$158: IC120.12(Q5) IC125.2(A:A1)
N$159: IC120.15(Q6) IC125.4(A:A2)
N$160: IC120.16(Q7) IC125.6(A:A3)
N$161: IC120.19(Q8) IC125.8(A:A4)
N$162: IC122.1(A:G) IC123.1(A:G)
N$163: IC124.1(A:G) IC125.1(A:G)
N$164: IC11.8(A:A4) IC12.8(A:A4) IC21.19(Q8) IC31.8(A:A4)
N$165: IC12.1(A:G) IC13.1(A:G)
N$166: IC10.1(A:G) IC11.1(A:G)
N$167: SW3.2
N$168: IC145.19(B:G) IC146.19(B:G)
N$169: IC10.18(A:Y1)
N$170: IC10.16(A:Y2)
N$171: IC10.14(A:Y3)
N$172: IC10.12(A:Y4)
N$175: IC47.5(2A) IC58.3(A:O)
N$176: IC14.7(CN) IC56.7(1Y)
N$177: IC13.18(A:Y1)
N$178: IC13.16(A:Y2)
N$179: IC13.14(A:Y3)
N$180: IC13.12(A:Y4)
N$181: IC12.18(A:Y1)
N$182: IC12.16(A:Y2)
N$183: IC12.14(A:Y3)
N$184: IC12.12(A:Y4)
N$185: IC47.2(1A) IC199.5(A:O)
N$188: IC147.2 IC179.3(A:O)
N$189: IC147.1 IC174.3(A:O)
N$191: IC22.7(2Y)
N$192: IC22.9(3Y)
N$193: IC22.12(4Y)
N$194: IC23.4(1Y)
N$195: IC23.7(2Y)
N$196: IC23.9(3Y)
N$197: IC23.12(4Y)
N$198: IC22.3(1B)
N$199: IC22.6(2B)
N$200: IC30.18(A:Y1)
N$201: IC30.16(A:Y2)
N$202: IC22.1(!A!/B) IC23.1(!A!/B)
N$203: IC30.14(A:Y3)
N$204: IC30.12(A:Y4)
N$205: IC30.1(A:G) IC31.1(A:G)
N$206: IC31.18(A:Y1)
N$207: IC31.16(A:Y2)
N$208: IC31.14(A:Y3)
N$209: IC31.12(A:Y4)
N$210: IC22.4(1Y)
N$211: IC22.10(3B)
N$212: IC22.13(4B)
N$213: IC23.3(1B)
N$214: IC23.6(2B)
N$215: IC23.10(3B)
N$216: IC23.13(4B)
N$217: IC94.2(Q1) IC95.2(A:A1)
N$218: IC46.7(3D) IC47.9(3Y)
N$219: IC46.8(4D) IC47.12(4Y)
N$220: IC147.9(A0) IC153.11(B:A1) IC222.1(A)
N$221: IC147.4 IC155.4(B:O)
N$224: IC149.8(C:O) IC167.1(A:I0)
N$225: IC147.7(A1) IC153.13(B:A2) IC222.2(B)
N$226: IC147.6(A2) IC153.15(B:A3) IC222.3(C)
N$229: IC149.11(D:O) IC174.1(A:I0)
N$230: IC159.4(D2) IC169.5(A:Q)
N$231: IC159.7(D3) IC161.5(A:Q)
N$234: IC49.11(D:O) IC179.1(A:I0)
N$236: IC147.13 IC167.3(A:O)
N$237: IC159.8(D4) IC162.5(A:Q)
N$238: IC159.13(D5) IC163.5(A:Q)
N$239: IC32.3(D1) IC41.7(1Y)
N$240: IC32.11(CLK) IC33.11(CLK)
N$241: IC32.1(CLR) IC33.1(CLR)
N$242: IC32.4(D2) IC41.9(2Y)
N$243: IC32.7(D3) IC40.7(1Y)
N$244: IC32.8(D4) IC40.9(2Y)
N$245: IC32.13(D5) IC34.7(1Y)
N$246: IC32.14(D6) IC34.9(2Y)
N$247: IC33.3(D1) IC35.7(1Y)
N$248: IC33.4(D2) IC35.9(2Y)
N$249: IC147.14(GS) IC183.3(B:I)
N$250: IC33.7(D3) IC36.7(1Y)
N$251: U$2.10(A0)
N$252: U$2.9(A1)
N$253: U$2.8(A2)
N$254: U$2.7(A3)
N$255: U$2.6(A4)
N$256: U$2.5(A5)
N$257: U$2.4(A6)
N$258: U$2.3(A7)
N$259: U$2.25(A8)
N$260: U$2.24(A9)
N$261: U$2.21(A10)
N$262: U$2.23(A11)
N$263: U$2.2(A12)
N$264: U$2.26(A13)
N$265: U$3.10(A0)
N$266: U$3.9(A1)
N$267: U$3.8(A2)
N$268: U$3.7(A3)
N$269: U$3.6(A4)
N$270: U$3.5(A5)
N$271: U$3.4(A6)
N$272: U$3.3(A7)
N$273: U$3.25(A8)
N$274: U$3.24(A9)
N$275: U$3.21(A10)
N$276: U$3.23(A11)
N$277: U$3.2(A12)
N$278: U$3.26(A13)
N$279: U$4.10(A0)
N$280: U$4.9(A1)
N$281: U$4.8(A2)
N$282: U$4.7(A3)
N$283: U$4.6(A4)
N$284: U$4.5(A5)
N$285: U$4.4(A6)
N$286: U$4.3(A7)
N$287: U$4.25(A8)
N$288: U$4.24(A9)
N$289: U$4.21(A10)
N$290: U$4.23(A11)
N$291: U$4.2(A12)
N$292: U$4.26(A13)
N$293: U$5.10(A0)
N$294: U$5.9(A1)
N$295: U$5.8(A2)
N$296: U$5.7(A3)
N$297: U$5.6(A4)
N$298: U$5.5(A5)
N$299: U$5.4(A6)
N$300: U$5.3(A7)
N$301: U$5.25(A8)
N$302: U$5.24(A9)
N$303: U$5.21(A10)
N$304: U$5.23(A11)
N$305: U$5.2(A12)
N$306: U$5.26(A13)
N$307: IC33.8(D4) IC36.9(2Y)
N$308: IC33.13(D5) IC37.7(1Y)
N$309: IC33.14(D6) IC37.9(2Y)
N$310: IC33.17(D7) IC38.7(1Y)
N$311: IC33.18(D8) IC38.9(2Y)
N$312: IC55.2(A:I1) IC147.15(EO)
N$313: IC55.1(A:I0) IC183.4(B:O)
N$315: IC169.1(A:CLR) IC222.14(Y1)
N$316: IC159.14(D6) IC168.5(A:Q)
N$317: IC159.17(D7) IC175.5(A:Q)
N$320: IC20.2(Q1) IC35.4(1C2)
N$321: IC94.5(Q2) IC95.4(A:A2)
N$322: IC148.11(D:O) IC185.1(A:I0)
N$323: IC94.6(Q3) IC95.6(A:A3)
N$324: IC159.18(D8) IC221.5(A:Q)
N$325: IC161.1(A:CLR) IC222.13(Y2)
N$326: IC20.5(Q2) IC35.12(2C2)
N$327: IC20.6(Q3) IC36.4(1C2)
N$328: IC20.9(Q4) IC36.12(2C2)
N$329: IC20.12(Q5) IC37.4(1C2)
N$330: IC20.15(Q6) IC37.12(2C2)
N$331: IC162.1(A:CLR) IC222.12(Y3)
N$332: IC190.9(4Q) IC191.17(B:A4)
N$333: IC50.5(A1)
N$334: IC50.3(A2)
N$335: IC50.14(A3)
N$336: IC50.12(A4)
N$337: IC52.5(A1)
N$338: IC51.5(A1)
N$339: IC51.3(A2)
N$340: IC51.14(A3)
N$341: IC51.12(A4)
N$342: IC20.16(Q7) IC38.4(1C2)
N$343: IC20.19(Q8) IC38.12(2C2)
N$344: IC41.6(1C0) IC50.4(S1)
N$345: IC41.10(2C0) IC50.1(S2)
N$346: IC40.6(1C0) IC50.13(S3)
N$347: IC190.12(5Q) IC192.11(B:A1)
N$348: IC190.15(6Q) IC192.13(B:A2)
N$349: IC40.10(2C0) IC50.10(S4)
N$350: IC52.3(A2)
N$351: IC52.14(A3)
N$352: IC52.12(A4)
N$353: IC53.5(A1)
N$354: IC53.3(A2)
N$355: IC94.9(Q4) IC95.8(A:A4)
N$356: IC94.12(Q5) IC96.2(A:A1)
N$357: IC50.9(C4) IC51.7(C0)
N$358: IC51.9(C4) IC52.7(C0)
N$359: IC52.9(C4) IC53.7(C0)
N$360: IC76.5(Q2)
N$361: IC34.6(1C0) IC51.4(S1)
N$362: IC34.10(2C0) IC51.1(S2)
N$363: IC35.6(1C0) IC51.13(S3)
N$364: IC76.6(Q3)
N$365: IC190.16(7Q) IC192.15(B:A3)
N$366: IC35.10(2C0) IC51.10(S4)
N$367: IC75.4(D2) U$1.12(I/O1)
N$368: IC190.19(8Q) IC192.17(B:A4)
N$369: IC75.7(D3) U$1.13(I/O2)
N$370: IC46.3(1D) IC47.4(1Y)
N$371: IC15.16(CN+4) IC58.2(A:I1)
N$372: IC128.2(1Q) IC193.11(B:A1)
N$373: IC56.3(1C3) IC57.2(A:O)
N$374: IC128.5(2Q) IC193.13(B:A2)
N$375: IC75.8(D4) U$1.15(I/O3)
N$376: IC75.13(D5) U$1.16(I/O4)
N$377: IC75.14(D6) U$1.17(I/O5)
N$378: IC60.3(D1) U$10.11(I/O0)
N$379: IC60.4(D2) U$10.12(I/O1)
N$380: IC60.7(D3) U$10.13(I/O2)
N$381: IC60.8(D4) U$10.15(I/O3)
N$382: IC60.13(D5) U$10.16(I/O4)
N$383: IC60.14(D6) U$10.17(I/O5)
N$384: IC60.17(D7) U$10.18(I/O6)
N$385: IC60.18(D8) U$10.19(I/O7)
N$386: IC61.3(D1) U$11.11(I/O0)
N$387: IC61.4(D2) U$11.12(I/O1)
N$388: IC128.6(3Q) IC193.15(B:A3)
N$389: IC128.9(4Q) IC193.17(B:A4)
N$390: IC128.12(5Q) IC194.11(B:A1)
N$391: IC76.9(Q4)
N$392: IC128.15(6Q) IC194.13(B:A2)
N$393: IC39.2(A:I1) IC43.4(B:O)
N$394: IC39.3(A:O) IC66.1(A:I0)
N$395: IC45.4(B:O) IC66.2(A:I1)
N$396: IC42.4(B:O) IC68.2(A:I1)
N$397: IC66.3(A:O) IC67.4(B:I0)
N$398: IC67.5(B:I1) IC68.3(A:O)
N$399: IC36.6(1C0) IC52.4(S1)
N$400: IC76.12(Q5)
N$401: IC76.15(Q6)
N$402: IC76.16(Q7)
N$403: IC94.15(Q6) IC96.4(A:A2)
N$404: IC6.5(Q2) IC111.13(B:A2)
N$405: IC94.16(Q7) IC96.6(A:A3)
N$406: IC36.10(2C0) IC52.1(S2)
N$407: IC94.19(Q8) IC96.8(A:A4)
N$408: IC93.2(Q1) IC97.2(A:A1)
N$409: IC37.6(1C0) IC52.13(S3)
N$410: IC37.10(2C0) IC52.10(S4)
N$411: IC38.6(1C0) IC53.4(S1)
N$412: IC53.1(S2)
N$413: IC93.5(Q2) IC97.4(A:A2)
N$414: IC93.6(Q3) IC97.6(A:A3)
N$415: IC93.9(Q4) IC97.8(A:A4)
N$416: IC93.12(Q5) IC119.2(A:A1)
N$417: IC93.15(Q6) IC119.4(A:A2)
N$418: IC93.16(Q7) IC119.6(A:A3)
N$419: IC128.16(7Q) IC194.15(B:A3)
N$420: IC93.19(Q8) IC119.8(A:A4)
N$421: IC128.19(8Q) IC194.17(B:A4)
N$422: IC95.1(A:G) IC96.1(A:G)
N$423: IC97.1(A:G) IC119.1(A:G)
N$424: IC17.2(Q1) IC82.2(A:A1)
N$425: IC17.5(Q2) IC82.4(A:A2)
N$426: IC17.6(Q3) IC82.6(A:A3)
N$427: IC17.9(Q4) IC82.8(A:A4)
N$428: IC17.12(Q5) IC83.2(A:A1)
N$429: IC17.15(Q6) IC83.4(A:A2)
N$430: IC17.16(Q7) IC83.6(A:A3)
N$431: IC17.19(Q8) IC83.8(A:A4)
N$432: IC16.2(Q1) IC84.2(A:A1)
N$433: IC16.5(Q2) IC84.4(A:A2)
N$434: IC16.6(Q3) IC84.6(A:A3)
N$435: IC16.9(Q4) IC84.8(A:A4)
N$436: IC16.12(Q5) IC85.2(A:A1)
N$437: IC16.15(Q6) IC85.4(A:A2)
N$438: IC16.16(Q7) IC85.6(A:A3)
N$439: IC16.19(Q8) IC85.8(A:A4)
N$440: IC76.19(Q8)
N$441: IC82.1(A:G) IC83.1(A:G)
N$442: IC76.3(D1) U$2.11(I/O0)
N$443: IC76.4(D2) U$2.12(I/O1)
N$444: IC84.1(A:G) IC85.1(A:G)
N$445: IC77.2(Q1)
N$446: IC197.5(A:O) IC198.1(A:I)
N$447: IC77.5(Q2)
N$448: IC61.7(D3) U$11.13(I/O2)
N$449: IC75.17(D7) U$1.18(I/O6)
N$450: IC75.18(D8) U$1.19(I/O7)
N$451: IC76.7(D3) U$2.13(I/O2)
N$452: IC76.8(D4) U$2.15(I/O3)
N$453: IC76.13(D5) U$2.16(I/O4)
N$454: IC76.14(D6) U$2.17(I/O5)
N$455: IC76.17(D7) U$2.18(I/O6)
N$456: IC76.18(D8) U$2.19(I/O7)
N$457: IC77.3(D1) U$3.11(I/O0)
N$458: IC77.4(D2) U$3.12(I/O1)
N$459: IC77.7(D3) U$3.13(I/O2)
N$460: IC77.8(D4) U$3.15(I/O3)
N$461: IC77.13(D5) U$3.16(I/O4)
N$462: IC77.14(D6) U$3.17(I/O5)
N$463: IC77.17(D7) U$3.18(I/O6)
N$464: IC77.18(D8) U$3.19(I/O7)
N$465: IC78.3(D1) U$4.11(I/O0)
N$466: IC78.4(D2) U$4.12(I/O1)
N$467: IC78.7(D3) U$4.13(I/O2)
N$468: IC78.8(D4) U$4.15(I/O3)
N$469: IC78.13(D5) U$4.16(I/O4)
N$470: IC78.14(D6) U$4.17(I/O5)
N$471: IC78.17(D7) U$4.18(I/O6)
N$472: IC78.18(D8) U$4.19(I/O7)
N$473: IC79.3(D1) U$5.11(I/O0)
N$474: IC79.4(D2) U$5.12(I/O1)
N$475: IC79.7(D3) U$5.13(I/O2)
N$476: IC79.8(D4) U$5.15(I/O3)
N$477: IC79.13(D5) U$5.16(I/O4)
N$478: IC79.14(D6) U$5.17(I/O5)
N$479: IC79.17(D7) U$5.18(I/O6)
N$480: IC79.18(D8) U$5.19(I/O7)
N$481: IC198.2(A:O) IC199.1(A:I0)
N$482: IC61.8(D4) U$11.15(I/O3)
N$483: IC61.13(D5) U$11.16(I/O4)
N$484: IC61.14(D6) U$11.17(I/O5)
N$485: IC61.17(D7) U$11.18(I/O6)
N$486: IC61.18(D8) U$11.19(I/O7)
N$487: IC62.3(D1) U$12.11(I/O0)
N$488: IC62.4(D2) U$12.12(I/O1)
N$489: IC62.7(D3) U$12.13(I/O2)
N$490: IC62.8(D4) U$12.15(I/O3)
N$491: IC62.13(D5) U$12.16(I/O4)
N$492: IC62.14(D6) U$12.17(I/O5)
N$493: IC62.17(D7) U$12.18(I/O6)
N$494: IC62.18(D8) U$12.19(I/O7)
N$495: IC200.6(Q3) IC201.6(A:A3)
N$496: IC200.9(Q4) IC201.8(A:A4)
N$497: IC200.12(Q5) IC202.2(A:A1)
N$498: IC200.15(Q6) IC202.4(A:A2)
N$499: IC129.1(A:G) IC129.19(B:G)
N$500: IC200.16(Q7) IC202.6(A:A3)
N$501: IC200.19(Q8) IC202.8(A:A4)
N$502: IC63.2(Q1) IC203.2(A:A1)
N$503: IC134.18(D8) U$6.19(I/O7)
N$504: IC134.17(D7) U$6.18(I/O6)
N$505: IC134.14(D6) U$6.17(I/O5)
N$506: IC134.13(D5) U$6.16(I/O4)
N$507: IC134.8(D4) U$6.15(I/O3)
N$508: IC134.7(D3) U$6.13(I/O2)
N$509: IC134.4(D2) U$6.12(I/O1)
N$510: IC134.3(D1) U$6.11(I/O0)
N$511: IC135.3(D1) U$7.11(I/O0)
N$512: IC135.4(D2) U$7.12(I/O1)
N$513: IC135.7(D3) U$7.13(I/O2)
N$514: IC135.8(D4) U$7.15(I/O3)
N$515: IC135.13(D5) U$7.16(I/O4)
N$516: IC135.14(D6) U$7.17(I/O5)
N$517: IC135.17(D7) U$7.18(I/O6)
N$518: IC135.18(D8) U$7.19(I/O7)
N$519: IC136.3(D1) U$8.11(I/O0)
N$520: IC136.4(D2) U$8.12(I/O1)
N$521: IC136.7(D3) U$8.13(I/O2)
N$522: IC136.8(D4) U$8.15(I/O3)
N$523: IC136.13(D5) U$8.16(I/O4)
N$524: IC136.14(D6) U$8.17(I/O5)
N$525: IC136.17(D7) U$8.18(I/O6)
N$526: IC136.18(D8) U$8.19(I/O7)
N$527: IC137.3(D1) U$9.11(I/O0)
N$528: IC87.3(A:S2) R1.1 S1.1(O)
N$529: IC87.1(A:R) R2.1 S1.3(S)
N$530: IC44.3(A:CLK) IC54.3(A:CLK) IC139.7(CLK) SW3.C
N$531: IC87.4(A:Q) SW3.1
N$532: SW3.4
N$533: IC137.4(D2) U$9.12(I/O1)
N$534: IC137.7(D3) U$9.13(I/O2)
N$535: IC137.8(D4) U$9.15(I/O3)
N$536: IC137.13(D5) U$9.16(I/O4)
N$537: IC137.14(D6) U$9.17(I/O5)
N$538: IC137.17(D7) U$9.18(I/O6)
N$539: IC137.18(D8) U$9.19(I/O7)
N$540: IC63.5(Q2) IC203.4(A:A2)
N$541: IC63.6(Q3) IC203.6(A:A3)
N$542: IC63.9(Q4) IC203.8(A:A4)
N$543: IC63.12(Q5) IC204.2(A:A1)
N$544: IC63.15(Q6) IC204.4(A:A2)
N$545: IC63.16(Q7) IC204.6(A:A3)
N$546: IC63.19(Q8) IC204.8(A:A4)
N$547: IC201.1(A:G) IC202.1(A:G)
N$548: IC57.3(B:I) IC139.3(Q1)
N$549: IC203.1(A:G) IC204.1(A:G)
N$550: IC48.2(Q1) IC205.2(A:A1)
N$551: IC48.5(Q2) IC205.4(A:A2)
N$552: IC48.6(Q3) IC205.6(A:A3)
N$553: IC48.9(Q4) IC205.8(A:A4)
N$554: IC48.12(Q5) IC206.2(A:A1)
N$555: IC48.15(Q6) IC206.4(A:A2)
N$556: IC48.16(Q7) IC206.6(A:A3)
N$557: IC48.19(Q8) IC206.8(A:A4)
N$558: IC73.2(1A) IC142.7(1Y)
N$559: IC4.2(Q1) IC207.2(A:A1)
N$560: IC4.5(Q2) IC207.4(A:A2)
N$561: IC4.6(Q3) IC207.6(A:A3)
N$562: IC4.9(Q4) IC207.8(A:A4)
N$563: IC4.12(Q5) IC208.2(A:A1)
N$564: IC77.6(Q3)
N$565: IC4.15(Q6) IC208.4(A:A2)
N$566: IC4.16(Q7) IC208.6(A:A3)
N$567: IC81.6(B:O) IC142.11(2C1)
N$568: IC77.9(Q4)
N$569: IC18.6(B:O) IC142.13(2C3)
N$570: IC4.19(Q8) IC208.8(A:A4)
N$571: IC77.12(Q5)
N$572: IC205.1(A:G) IC206.1(A:G)
N$573: IC207.1(A:G) IC208.1(A:G)
N$574: IC210.2(Q1) IC211.2(A:A1)
N$575: IC210.5(Q2) IC211.4(A:A2)
N$576: IC210.6(Q3) IC211.6(A:A3)
N$577: IC6.6(Q3) IC111.15(B:A3)
N$578: IC6.9(Q4) IC111.17(B:A4)
N$579: IC6.12(Q5) IC112.11(B:A1)
N$580: IC6.15(Q6) IC112.13(B:A2)
N$581: IC6.16(Q7) IC112.15(B:A3)
N$582: IC6.19(Q8) IC112.17(B:A4)
N$583: IC98.2(Q1) IC113.11(B:A1)
N$584: IC98.5(Q2) IC113.13(B:A2)
N$585: IC98.6(Q3) IC113.15(B:A3)
N$586: IC98.9(Q4) IC113.17(B:A4)
N$587: IC98.12(Q5) IC114.11(B:A1)
N$588: IC98.15(Q6) IC114.13(B:A2)
N$589: IC98.16(Q7) IC114.15(B:A3)
N$590: IC98.19(Q8) IC114.17(B:A4)
N$591: IC99.2(Q1) IC115.11(B:A1)
N$592: IC99.5(Q2) IC115.13(B:A2)
N$593: IC99.6(Q3) IC115.15(B:A3)
N$594: IC99.9(Q4) IC115.17(B:A4)
N$595: IC99.12(Q5) IC116.11(B:A1)
N$596: IC99.15(Q6) IC116.13(B:A2)
N$597: IC99.16(Q7) IC116.15(B:A3)
N$598: IC99.19(Q8) IC116.17(B:A4)
N$599: IC113.19(B:G) IC114.19(B:G)
N$600: IC115.19(B:G) IC116.19(B:G)
N$601: IC210.9(Q4) IC211.8(A:A4)
N$602: IC77.15(Q6)
N$603: IC210.12(Q5) IC212.2(A:A1)
N$604: IC210.15(Q6) IC212.4(A:A2)
N$605: IC77.16(Q7)
N$606: IC77.19(Q8)
N$607: IC78.2(Q1)
N$608: IC78.5(Q2)
N$609: IC78.6(Q3)
N$610: IC78.9(Q4)
N$611: IC78.12(Q5)
N$612: IC78.15(Q6)
N$613: IC78.16(Q7)
N$614: IC78.19(Q8)
N$615: IC79.2(Q1)
N$616: IC79.5(Q2)
N$617: IC79.6(Q3)
N$618: IC79.9(Q4)
N$619: IC79.12(Q5)
N$620: IC79.15(Q6)
N$621: IC79.16(Q7)
N$622: IC79.19(Q8)
N$623: IC134.2(Q1)
N$624: IC134.5(Q2)
N$625: IC134.6(Q3)
N$626: IC134.9(Q4)
N$627: IC134.12(Q5)
N$628: IC134.15(Q6)
N$629: IC134.16(Q7)
N$630: IC134.19(Q8)
N$631: IC135.2(Q1)
N$632: IC135.5(Q2)
N$633: IC135.6(Q3)
N$634: IC135.9(Q4)
N$635: IC135.12(Q5)
N$636: IC135.15(Q6)
N$637: IC135.16(Q7)
N$638: IC135.19(Q8)
N$639: IC136.2(Q1)
N$640: IC136.5(Q2)
N$641: IC136.6(Q3)
N$642: IC136.9(Q4)
N$643: IC136.12(Q5)
N$644: IC136.15(Q6)
N$645: IC136.16(Q7)
N$646: IC136.19(Q8)
N$647: IC137.2(Q1)
N$648: IC137.5(Q2)
N$649: IC137.6(Q3)
N$650: IC137.9(Q4)
N$651: IC137.12(Q5)
N$652: IC137.15(Q6)
N$653: IC137.16(Q7)
N$654: IC137.19(Q8)
N$655: IC210.16(Q7) IC212.6(A:A3)
N$656: IC210.19(Q8) IC212.8(A:A4)
N$657: IC209.2(Q1) IC213.2(A:A1)
N$658: IC209.5(Q2) IC213.4(A:A2)
N$659: IC209.6(Q3) IC213.6(A:A3)
N$660: IC209.9(Q4) IC213.8(A:A4)
N$661: IC209.12(Q5) IC214.2(A:A1)
N$662: IC209.15(Q6) IC214.4(A:A2)
N$663: IC209.16(Q7) IC214.6(A:A3)
N$664: IC209.19(Q8) IC214.8(A:A4)
N$665: IC211.1(A:G) IC212.1(A:G)
N$666: IC213.1(A:G) IC214.1(A:G)
N$667: IC216.2(Q1) IC217.2(A:A1)
N$668: IC216.5(Q2) IC217.4(A:A2)
N$669: IC216.6(Q3) IC217.6(A:A3)
N$670: IC216.9(Q4) IC217.8(A:A4)
N$671: IC216.12(Q5) IC218.2(A:A1)
N$672: IC216.15(Q6) IC218.4(A:A2)
N$673: IC216.16(Q7) IC218.6(A:A3)
N$674: IC216.19(Q8) IC218.8(A:A4)
N$675: IC215.2(Q1) IC219.2(A:A1)
N$676: IC215.5(Q2) IC219.4(A:A2)
N$677: IC215.6(Q3) IC219.6(A:A3)
N$678: IC215.9(Q4) IC219.8(A:A4)
N$679: IC215.12(Q5) IC220.2(A:A1)
N$680: IC215.15(Q6) IC220.4(A:A2)
N$681: IC215.16(Q7) IC220.6(A:A3)
N$682: IC215.19(Q8) IC220.8(A:A4)
N$683: IC217.1(A:G) IC218.1(A:G)
N$684: IC219.1(A:G) IC220.1(A:G)
N$685: IC163.1(A:CLR) IC222.11(Y4)
N$686: IC168.1(A:CLR) IC222.10(Y5)
N$687: IC175.1(A:CLR) IC222.9(Y6)
N$688: IC221.1(A:CLR) IC222.7(Y7)
NOT_COND: IC74.4(B:I0)
NOT_RST: IC4.1(CLR) IC5.1(CLR) IC6.1(CLR) IC7.1(CLR) IC8.1(CLR) IC16.1(CLR) IC17.1(CLR) IC20.1(CLR) IC21.1(CLR) IC48.1(CLR) IC63.1(CLR) IC75.1(CLR) IC76.1(CLR) IC77.1(CLR) IC78.1(CLR) IC79.1(CLR) IC86.1(CLR) IC88.1(CLR) IC93.1(CLR) IC94.1(CLR) IC99.1(CLR) IC103.1(CLR) IC104.1(CLR) IC120.1(CLR) IC121.1(CLR) IC134.1(CLR) IC135.1(CLR) IC136.1(CLR) IC137.1(CLR) IC200.1(CLR) IC209.1(CLR) IC210.1(CLR) IC215.1(CLR) IC216.1(CLR)
OF: IC46.9(4Q) IC59.14(4A) IC195.17(B:A4)
OF_FROM_ALU: IC47.14(4A) IC126.8(4D)
RD: IC10.11(B:A1) IC75.16(Q7)
RST: IC54.2(A:D) IC54.5(A:Q) IC139.15(CLR) R3.1 S2.2(P)
RST5.5: IC161.3(A:CLK)
RST6.5: IC162.3(A:CLK)
RST_4.5: IC127.13(B:A2) IC159.5(Q2) IC185.2(A:I1)
RST_5.5: IC127.15(B:A3) IC159.6(Q3) IC179.2(A:I1)
RST_6.5: IC127.17(B:A4) IC159.9(Q4) IC174.2(A:I1)
RST_7.5: IC152.11(B:A1) IC159.12(Q5) IC167.2(A:I1)
RST_8.5: IC147.12 IC152.13(B:A2) IC159.15(Q6)
SF: IC46.6(3Q) IC59.11(3A) IC195.15(B:A3)
SF_FROM_ALU: IC126.7(3D)
SF_XOR_OF: IC72.6(B:O) IC81.4(B:I0) IC142.10(2C0)
STOP_CLK: IC44.5(A:Q) IC139.1(M) IC139.2(N)
TRAP: IC169.3(A:CLK)
TYP_0: IC39.1(A:I0) IC42.3(B:I) IC69.1(A:I0)
TYP_1: IC43.3(B:I) IC68.1(A:I0) IC69.2(A:I1)
U_AD0: IC32.2(Q1) IC140.2(A1) U$6.10(A0) U$7.10(A0) U$8.10(A0) U$9.10(A0)
U_AD1: IC32.5(Q2) IC140.3(A2) U$6.9(A1) U$7.9(A1) U$8.9(A1) U$9.9(A1)
U_AD2: IC32.6(Q3) IC140.4(A3) U$6.8(A2) U$7.8(A2) U$8.8(A2) U$9.8(A2)
U_AD3: IC32.9(Q4) IC140.5(A4) U$6.7(A3) U$7.7(A3) U$8.7(A3) U$9.7(A3)
U_AD4: IC32.12(Q5) IC140.6(A5) U$6.6(A4) U$7.6(A4) U$8.6(A4) U$9.6(A4)
U_AD5: IC32.15(Q6) IC140.7(A6) U$6.5(A5) U$7.5(A5) U$8.5(A5) U$9.5(A5)
U_AD6: IC32.16(Q7) IC140.8(A7) U$6.4(A6) U$7.4(A6) U$8.4(A6) U$9.4(A6)
U_AD7: IC32.19(Q8) IC140.9(A8) U$6.3(A7) U$7.3(A7) U$8.3(A7) U$9.3(A7)
U_AD8: IC33.2(Q1) U$6.25(A8) U$7.25(A8) U$8.25(A8) U$9.25(A8)
U_AD9: IC33.5(Q2) IC118.2(A1) IC118.3(A2) U$6.24(A9) U$7.24(A9) U$8.24(A9) U$9.24(A9)
U_AD10: IC33.6(Q3) IC118.4(A3) U$6.21(A10) U$7.21(A10) U$8.21(A10) U$9.21(A10)
U_AD11: IC33.9(Q4) IC118.5(A4) U$6.23(A11) U$7.23(A11) U$8.23(A11) U$9.23(A11)
U_AD12: IC33.12(Q5) IC118.6(A5) U$6.2(A12) U$7.2(A12) U$8.2(A12) U$9.2(A12)
U_AD13: IC33.15(Q6) IC118.7(A6) U$6.26(A13) U$7.26(A13) U$8.26(A13) U$9.26(A13)
U_AD_BUFF0: IC140.18(Y1) U$1.10(A0)
U_AD_BUFF1: IC140.17(Y2) U$1.9(A1)
U_AD_BUFF2: IC140.16(Y3) U$1.8(A2)
U_AD_BUFF3: IC140.15(Y4) U$1.7(A3)
U_AD_BUFF4: IC140.14(Y5) U$1.6(A4)
U_AD_BUFF5: IC140.13(Y6) U$1.5(A5)
U_AD_BUFF6: IC140.12(Y7) U$1.4(A6)
U_AD_BUFF7: IC140.11(Y8) U$1.3(A7)
U_AD_BUFF8: IC118.18(Y1) U$1.25(A8)
U_AD_BUFF9: IC118.17(Y2) U$1.24(A9)
U_AD_BUFF10: IC118.16(Y3) U$1.21(A10)
U_AD_BUFF11: IC118.15(Y4) U$1.23(A11)
U_AD_BUFF12: IC118.14(Y5) U$1.2(A12)
U_AD_BUFF13: IC118.13(Y6) U$1.26(A13)
U_ADDR_MUX_0: IC34.14(A) IC35.14(A) IC36.14(A) IC37.14(A) IC38.14(A) IC40.14(A) IC41.14(A) IC67.6(B:O)
U_ADDR_MUX_1: IC34.2(B) IC35.2(B) IC36.2(B) IC37.2(B) IC38.2(B) IC40.2(B) IC41.2(B) IC69.3(A:O)
U_CF: IC59.6(2B) IC126.5(2Q)
U_FLAGS_WRT: IC126.1(G)
U_OF: IC59.13(4B) IC126.9(4Q)
U_SF: IC59.10(3B) IC126.6(3Q)
U_ZF: IC59.3(1B) IC126.2(1Q)
VCC: IC50.6(B1) IC56.5(1C1) IC161.2(A:D) IC162.2(A:D) IC163.2(A:D) IC168.2(A:D) IC169.2(A:D) IC175.2(A:D) IC221.2(A:D) IC222.6(G1) R1.2 R2.2 R3.2
WR: IC10.13(B:A2) IC75.19(Q8)
XBUS0: IC2.9(B:Y1) IC9.18(A:Y1) IC25.9(B:Y1) IC27.9(B:Y1) IC95.18(A:Y1) IC97.18(A:Y1) IC102.9(B:Y1) IC105.9(B:Y1) IC107.9(B:Y1) IC109.9(B:Y1) IC111.9(B:Y1) IC113.9(B:Y1) IC115.9(B:Y1) IC122.18(A:Y1) IC124.18(A:Y1) IC127.9(B:Y1) IC129.18(A:Y1) IC153.9(B:Y1) IC191.9(B:Y1) IC193.9(B:Y1) IC195.9(B:Y1)
XBUS1: IC2.7(B:Y2) IC9.16(A:Y2) IC25.7(B:Y2) IC27.7(B:Y2) IC95.16(A:Y2) IC97.16(A:Y2) IC102.7(B:Y2) IC105.7(B:Y2) IC107.7(B:Y2) IC109.7(B:Y2) IC111.7(B:Y2) IC113.7(B:Y2) IC115.7(B:Y2) IC122.16(A:Y2) IC124.16(A:Y2) IC127.7(B:Y2) IC129.16(A:Y2) IC153.7(B:Y2) IC191.7(B:Y2) IC193.7(B:Y2) IC195.7(B:Y2)
XBUS2: IC2.5(B:Y3) IC9.14(A:Y3) IC25.5(B:Y3) IC27.5(B:Y3) IC95.14(A:Y3) IC97.14(A:Y3) IC102.5(B:Y3) IC105.5(B:Y3) IC107.5(B:Y3) IC109.5(B:Y3) IC111.5(B:Y3) IC113.5(B:Y3) IC115.5(B:Y3) IC122.14(A:Y3) IC124.14(A:Y3) IC127.5(B:Y3) IC129.14(A:Y3) IC153.5(B:Y3) IC191.5(B:Y3) IC193.5(B:Y3) IC195.5(B:Y3)
XBUS3: IC2.3(B:Y4) IC9.12(A:Y4) IC25.3(B:Y4) IC27.3(B:Y4) IC95.12(A:Y4) IC97.12(A:Y4) IC102.3(B:Y4) IC105.3(B:Y4) IC107.3(B:Y4) IC109.3(B:Y4) IC111.3(B:Y4) IC113.3(B:Y4) IC115.3(B:Y4) IC122.12(A:Y4) IC124.12(A:Y4) IC127.3(B:Y4) IC129.12(A:Y4) IC153.3(B:Y4) IC191.3(B:Y4) IC193.3(B:Y4) IC195.3(B:Y4)
XBUS4: IC3.9(B:Y1) IC9.9(B:Y1) IC24.9(B:Y1) IC26.9(B:Y1) IC96.18(A:Y1) IC106.9(B:Y1) IC108.9(B:Y1) IC110.9(B:Y1) IC112.9(B:Y1) IC114.9(B:Y1) IC116.9(B:Y1) IC117.9(B:Y1) IC119.18(A:Y1) IC123.18(A:Y1) IC125.18(A:Y1) IC129.9(B:Y1) IC152.9(B:Y1) IC154.9(B:Y1) IC192.9(B:Y1) IC194.9(B:Y1) IC196.9(B:Y1)
XBUS5: IC3.7(B:Y2) IC9.7(B:Y2) IC24.7(B:Y2) IC26.7(B:Y2) IC96.16(A:Y2) IC106.7(B:Y2) IC108.7(B:Y2) IC110.7(B:Y2) IC112.7(B:Y2) IC114.7(B:Y2) IC116.7(B:Y2) IC117.7(B:Y2) IC119.16(A:Y2) IC123.16(A:Y2) IC125.16(A:Y2) IC129.7(B:Y2) IC152.7(B:Y2) IC154.7(B:Y2) IC192.7(B:Y2) IC194.7(B:Y2) IC196.7(B:Y2)
XBUS6: IC3.5(B:Y3) IC9.5(B:Y3) IC24.5(B:Y3) IC26.5(B:Y3) IC96.14(A:Y3) IC106.5(B:Y3) IC108.5(B:Y3) IC110.5(B:Y3) IC112.5(B:Y3) IC114.5(B:Y3) IC116.5(B:Y3) IC117.5(B:Y3) IC119.14(A:Y3) IC123.14(A:Y3) IC125.14(A:Y3) IC129.5(B:Y3) IC152.5(B:Y3) IC154.5(B:Y3) IC192.5(B:Y3) IC194.5(B:Y3) IC196.5(B:Y3)
XBUS7: IC3.3(B:Y4) IC9.3(B:Y4) IC24.3(B:Y4) IC26.3(B:Y4) IC80.4(B:I0) IC96.12(A:Y4) IC106.3(B:Y4) IC108.3(B:Y4) IC110.3(B:Y4) IC112.3(B:Y4) IC114.3(B:Y4) IC116.3(B:Y4) IC117.3(B:Y4) IC119.12(A:Y4) IC123.12(A:Y4) IC125.12(A:Y4) IC129.3(B:Y4) IC130.5(B:I1) IC152.3(B:Y4) IC154.3(B:Y4) IC192.3(B:Y4) IC194.3(B:Y4) IC196.3(B:Y4)
XBUS8: IC145.9(B:Y1)
XBUS9: IC145.7(B:Y2)
XBUS10: IC145.5(B:Y3)
XBUS11: IC145.3(B:Y4)
XBUS12: IC146.9(B:Y1)
XBUS13: IC146.7(B:Y2)
XBUS14: IC146.5(B:Y3)
XBUS15: IC146.3(B:Y4)
XBUS16: IC82.18(A:Y1) IC84.18(A:Y1) IC89.18(A:Y1) IC91.18(A:Y1)
XBUS17: IC82.16(A:Y2) IC84.16(A:Y2) IC89.16(A:Y2) IC91.16(A:Y2)
XBUS18: IC82.14(A:Y3) IC84.14(A:Y3) IC89.14(A:Y3) IC91.14(A:Y3)
XBUS19: IC82.12(A:Y4) IC84.12(A:Y4) IC89.12(A:Y4) IC91.12(A:Y4)
XBUS20: IC83.18(A:Y1) IC85.18(A:Y1) IC90.18(A:Y1) IC92.18(A:Y1)
XBUS21: IC83.16(A:Y2) IC85.16(A:Y2) IC90.16(A:Y2) IC92.16(A:Y2)
XBUS22: IC83.14(A:Y3) IC85.14(A:Y3) IC90.14(A:Y3) IC92.14(A:Y3)
XBUS23: IC83.12(A:Y4) IC85.12(A:Y4) IC90.12(A:Y4) IC92.12(A:Y4)
XBUS24: IC217.18(A:Y1) IC219.18(A:Y1)
XBUS25: IC217.16(A:Y2) IC219.16(A:Y2)
XBUS26: IC217.14(A:Y3) IC219.14(A:Y3)
XBUS27: IC217.12(A:Y4) IC219.12(A:Y4)
XBUS28: IC218.18(A:Y1) IC220.18(A:Y1)
XBUS29: IC218.16(A:Y2) IC220.16(A:Y2)
XBUS30: IC218.14(A:Y3) IC220.14(A:Y3)
XBUS31: IC218.12(A:Y4) IC220.12(A:Y4)
YBUS0: IC19.18(A:Y1)
YBUS1: IC19.16(A:Y2)
YBUS2: IC19.14(A:Y3)
YBUS3: IC19.12(A:Y4)
YBUS4: IC19.9(B:Y1)
YBUS5: IC19.7(B:Y2)
YBUS6: IC19.5(B:Y3)
YBUS7: IC19.3(B:Y4) IC130.4(B:I0)
YBUS8: IC201.18(A:Y1) IC203.18(A:Y1) IC205.18(A:Y1) IC207.18(A:Y1)
YBUS9: IC201.16(A:Y2) IC203.16(A:Y2) IC205.16(A:Y2) IC207.16(A:Y2)
YBUS10: IC201.14(A:Y3) IC203.14(A:Y3) IC205.14(A:Y3) IC207.14(A:Y3)
YBUS11: IC201.12(A:Y4) IC205.12(A:Y4) IC207.12(A:Y4)
YBUS12: IC202.18(A:Y1) IC204.18(A:Y1) IC206.18(A:Y1) IC208.18(A:Y1)
YBUS13: IC202.16(A:Y2) IC204.16(A:Y2) IC206.16(A:Y2) IC208.16(A:Y2)
YBUS14: IC202.14(A:Y3) IC204.14(A:Y3) IC206.14(A:Y3) IC208.14(A:Y3)
YBUS15: IC202.12(A:Y4) IC204.12(A:Y4) IC206.12(A:Y4) IC208.12(A:Y4)
YBUS16: IC211.18(A:Y1) IC213.18(A:Y1)
YBUS17: IC211.16(A:Y2) IC213.16(A:Y2)
YBUS18: IC211.14(A:Y3) IC213.14(A:Y3)
YBUS19: IC211.12(A:Y4) IC213.12(A:Y4)
YBUS20: IC212.18(A:Y1) IC214.18(A:Y1)
YBUS21: IC212.16(A:Y2) IC214.16(A:Y2)
YBUS22: IC212.14(A:Y3) IC214.14(A:Y3)
YBUS23: IC212.12(A:Y4) IC214.12(A:Y4)
ZBUFF0_0: IC93.3(D1) IC94.3(D1) IC120.3(D1) IC121.3(D1)
ZBUFF0_1: IC93.4(D2) IC94.4(D2) IC120.4(D2) IC121.4(D2)
ZBUFF0_2: IC93.7(D3) IC94.7(D3) IC120.7(D3) IC121.7(D3)
ZBUFF0_3: IC93.8(D4) IC94.8(D4) IC120.8(D4) IC121.8(D4)
ZBUFF0_4: IC93.13(D5) IC94.13(D5) IC120.13(D5) IC121.13(D5)
ZBUFF0_5: IC93.14(D6) IC94.14(D6) IC120.14(D6)
ZBUFF0_6: IC93.17(D7) IC94.17(D7) IC120.17(D7) IC121.14(D6) IC121.17(D7)
ZBUFF0_7: IC93.18(D8) IC94.18(D8) IC120.18(D8) IC121.18(D8)
ZBUFF0_8: IC4.3(D1) IC48.3(D1) IC63.3(D1) IC200.3(D1)
ZBUFF0_9: IC4.4(D2) IC48.4(D2) IC63.4(D2) IC200.4(D2)
ZBUFF0_10: IC4.7(D3) IC48.7(D3) IC63.7(D3) IC200.7(D3)
ZBUFF0_11: IC4.8(D4) IC48.8(D4) IC63.8(D4) IC200.8(D4)
ZBUFF0_12: IC4.13(D5) IC48.13(D5) IC63.13(D5) IC200.13(D5)
ZBUFF0_13: IC4.14(D6) IC48.14(D6) IC63.14(D6) IC200.14(D6)
ZBUFF0_14: IC4.17(D7) IC48.17(D7) IC63.17(D7) IC200.17(D7)
ZBUFF0_15: IC4.18(D8) IC48.18(D8) IC63.18(D8) IC200.18(D8)
ZBUFF0_16: IC16.3(D1) IC17.3(D1) IC86.3(D1) IC88.3(D1)
ZBUFF0_17: IC16.4(D2) IC17.4(D2) IC86.4(D2) IC88.4(D2)
ZBUFF0_18: IC16.7(D3) IC17.7(D3) IC86.7(D3) IC88.7(D3)
ZBUFF0_19: IC16.8(D4) IC17.8(D4) IC86.8(D4) IC88.8(D4)
ZBUFF0_20: IC16.13(D5) IC17.13(D5) IC86.13(D5) IC88.13(D5)
ZBUFF0_21: IC16.14(D6) IC17.14(D6) IC86.14(D6)
ZBUFF0_22: IC16.17(D7) IC17.17(D7) IC86.17(D7) IC88.14(D6) IC88.17(D7)
ZBUFF0_23: IC16.18(D8) IC17.18(D8) IC86.18(D8) IC88.18(D8)
ZBUFF0_24: IC209.3(D1) IC210.3(D1)
ZBUFF0_25: IC209.4(D2) IC210.4(D2)
ZBUFF0_26: IC209.7(D3) IC210.7(D3)
ZBUFF0_27: IC209.8(D4) IC210.8(D4)
ZBUFF0_28: IC209.13(D5) IC210.13(D5)
ZBUFF0_29: IC209.14(D6) IC210.14(D6)
ZBUFF0_30: IC209.17(D7) IC210.17(D7)
ZBUFF0_31: IC209.18(D8) IC210.18(D8)
ZBUFF0_32: IC215.3(D1) IC216.3(D1)
ZBUFF0_33: IC215.4(D2) IC216.4(D2)
ZBUFF0_34: IC215.7(D3) IC216.7(D3)
ZBUFF0_35: IC215.8(D4) IC216.8(D4)
ZBUFF0_36: IC215.13(D5) IC216.13(D5)
ZBUFF0_37: IC215.14(D6) IC216.14(D6)
ZBUFF0_38: IC215.17(D7) IC216.17(D7)
ZBUFF0_39: IC215.18(D8) IC216.18(D8)
ZBUFF1_0: IC5.3(D1) IC6.3(D1) IC7.3(D1) IC8.3(D1) IC98.3(D1) IC99.3(D1) IC103.3(D1) IC104.3(D1)
ZBUFF1_1: IC5.4(D2) IC6.4(D2) IC7.4(D2) IC8.4(D2) IC98.4(D2) IC99.4(D2) IC103.4(D2) IC104.4(D2)
ZBUFF1_2: IC5.7(D3) IC6.7(D3) IC7.7(D3) IC8.7(D3) IC98.7(D3) IC99.7(D3) IC103.7(D3) IC104.7(D3)
ZBUFF1_3: IC5.8(D4) IC6.8(D4) IC7.8(D4) IC8.8(D4) IC98.8(D4) IC99.8(D4) IC103.8(D4) IC104.8(D4)
ZBUFF1_4: IC5.13(D5) IC6.13(D5) IC7.13(D5) IC8.13(D5) IC98.13(D5) IC99.13(D5) IC103.13(D5) IC104.13(D5)
ZBUFF1_5: IC5.14(D6) IC6.14(D6) IC7.14(D6) IC8.14(D6) IC98.14(D6) IC99.14(D6) IC103.14(D6) IC104.14(D6)
ZBUFF1_6: IC5.17(D7) IC6.17(D7) IC7.17(D7) IC8.17(D7) IC98.17(D7) IC99.17(D7) IC103.17(D7) IC104.17(D7)
ZBUFF1_7: IC5.18(D8) IC6.18(D8) IC7.18(D8) IC8.18(D8) IC98.18(D8) IC99.18(D8) IC103.18(D8) IC104.18(D8)
ZBUFF2_0: IC1.3(D1) IC23.14(4A) IC47.3(1B) IC100.3(D1) IC101.3(D1)
ZBUFF2_1: IC1.4(D2) IC23.11(3A) IC47.6(2B) IC100.4(D2) IC101.4(D2)
ZBUFF2_2: IC1.7(D3) IC23.5(2A) IC47.10(3B) IC100.7(D3) IC101.7(D3)
ZBUFF2_3: IC1.8(D4) IC23.2(1A) IC47.13(4B) IC100.8(D4) IC101.8(D4)
ZBUFF2_4: IC1.13(D5) IC22.14(4A) IC100.13(D5) IC101.13(D5)
ZBUFF2_5: IC1.14(D6) IC22.11(3A) IC100.14(D6) IC101.14(D6)
ZBUFF2_6: IC1.17(D7) IC22.5(2A) IC100.17(D7) IC101.17(D7)
ZBUFF2_7: IC1.18(D8) IC22.2(1A)
ZBUFF2_8: IC144.3(D1)
ZBUFF2_9: IC144.4(D2)
ZBUFF2_10: IC144.7(D3)
ZBUFF2_11: IC144.8(D4)
ZBUFF2_12: IC144.13(D5)
ZBUFF2_13: IC144.14(D6)
ZBUFF2_14: IC144.17(D7)
ZBUS0: IC14.9(F0) IC128.3(1D) IC190.3(1D) IC197.1(A:I0)
ZBUS1: IC14.10(F1) IC128.4(2D) IC190.4(2D) IC197.2(A:I1)
ZBUS2: IC14.11(F2) IC128.7(3D) IC190.7(3D) IC197.3(A:I2)
ZBUS3: IC14.13(F3) IC128.8(4D) IC190.8(4D) IC197.12(A:I3)
ZBUS4: IC15.13(F3) IC128.13(5D) IC190.13(5D) IC197.13(A:I4)
ZBUS5: IC15.11(F2) IC128.14(6D) IC190.14(6D) IC199.2(A:I1)
ZBUS6: IC15.10(F1) IC128.17(7D) IC190.17(7D) IC199.3(A:I2)
ZBUS7: IC15.9(F0) IC47.11(3A) IC80.5(B:I1) IC128.18(8D) IC190.18(8D) IC199.12(A:I3)
ZF: IC46.2(1Q) IC59.2(1A) IC195.11(B:A1)
ZF_FROM_ALU: IC126.3(1D)